# EAGLE design power electronicsV2.1 (EAGLE 9.6.2)

## Sheet 1 of 3
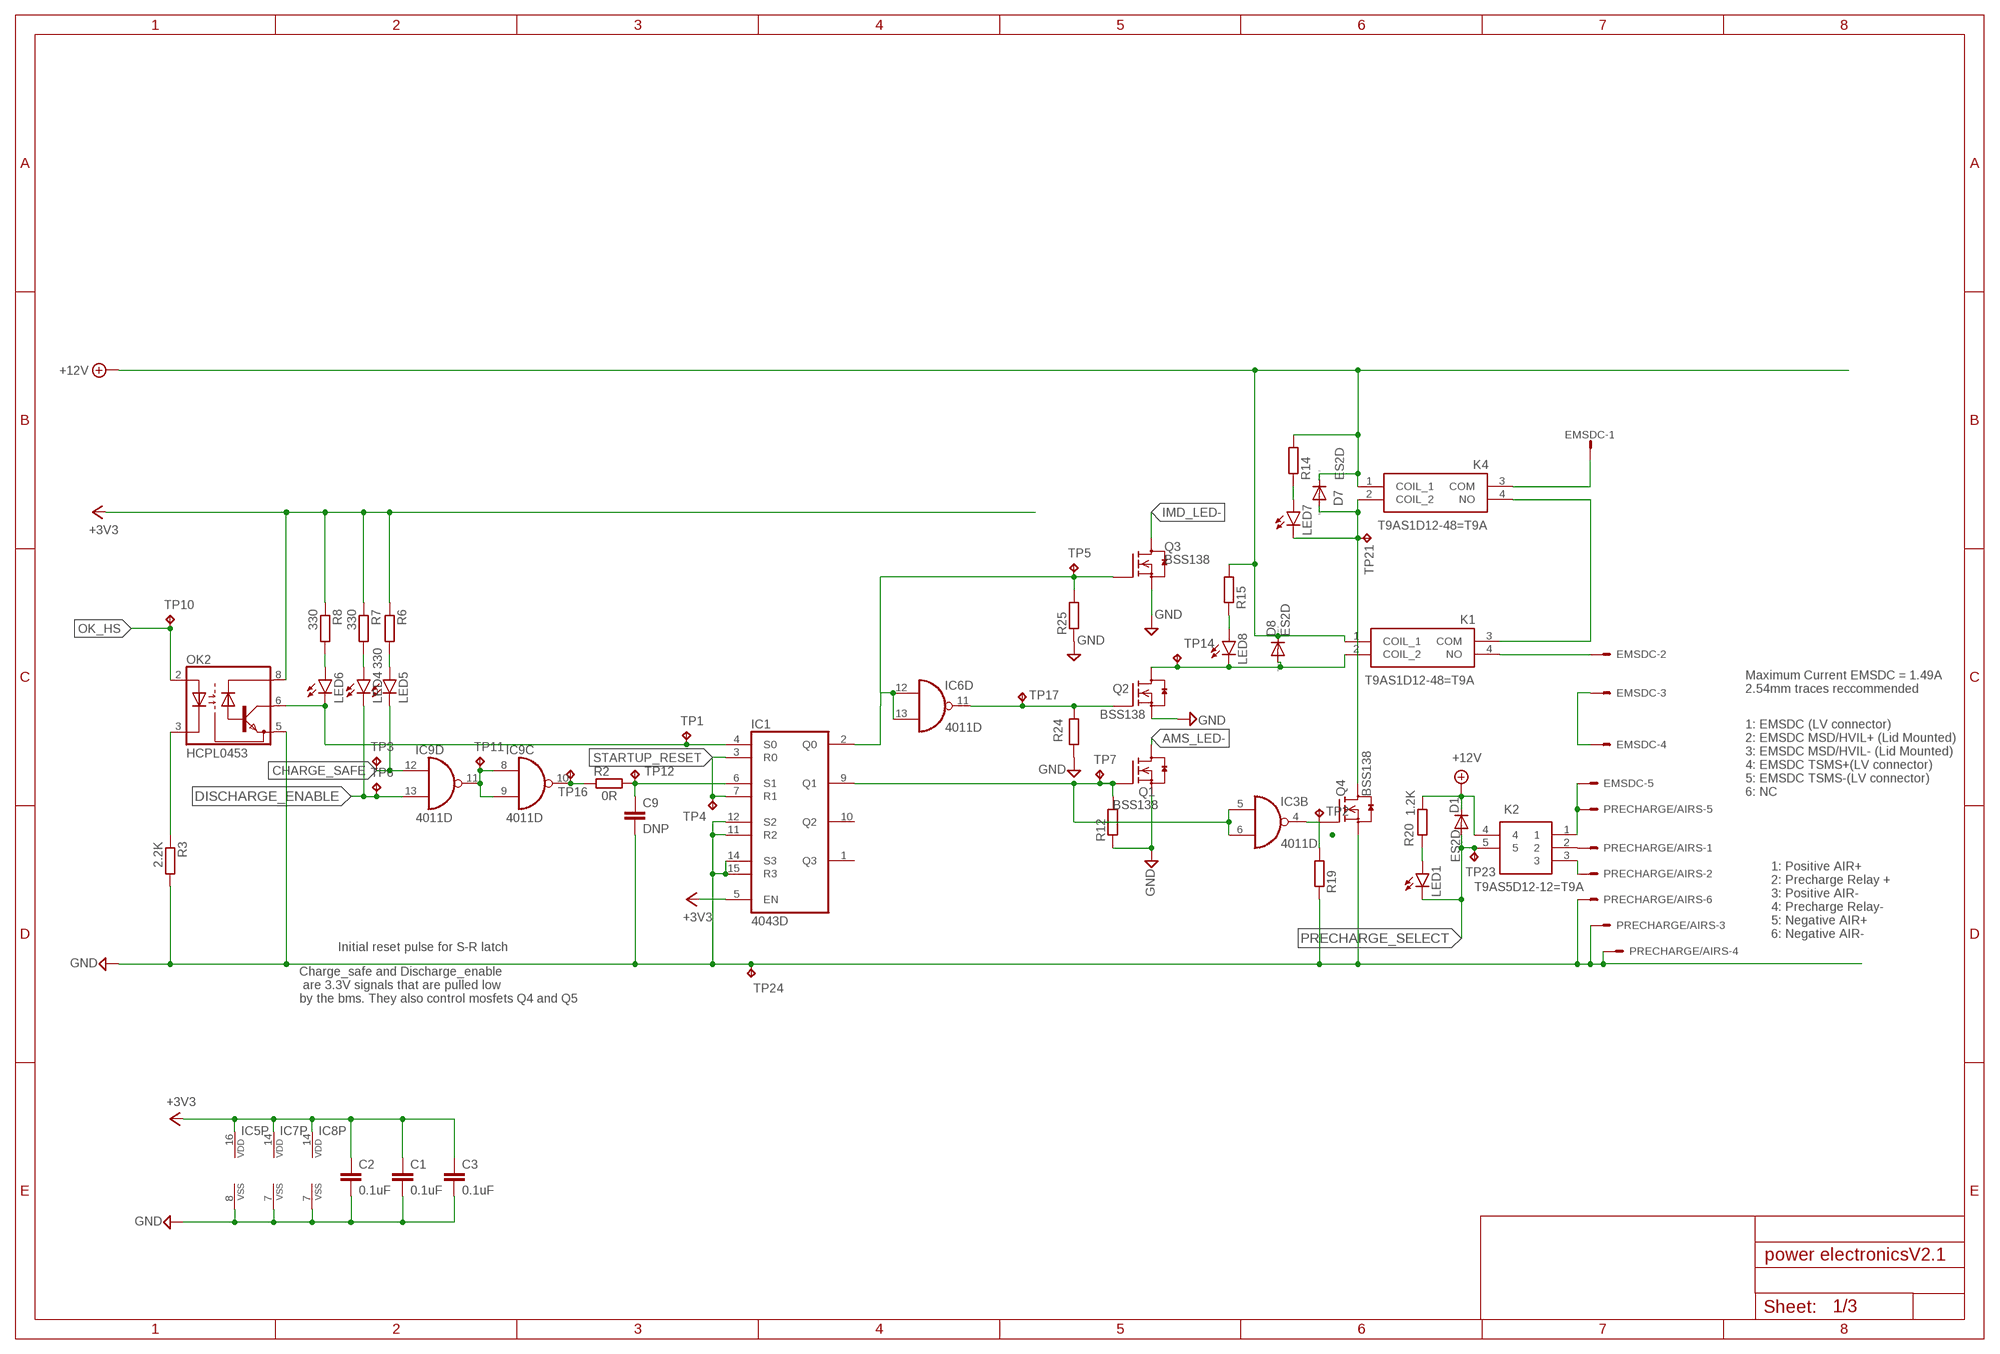
[diagram p0: schematic, sheet 1]

### Parts
C1  0.1uF  C-EUC0805  [C0805]
C2  0.1uF  C-EUC0805  [C0805]
C3  0.1uF  C-EUC0805  [C0805]
C9  DNP  C-EUC0805K  [C0805K]
D1  ES2D  [SMB]
D7  ES2D  [SMB]
D8  ES2D  [SMB]
EMSDC  KK-156-6  [KK-156-6]
IC1  4043D  [SO16]
IC3  4011D  [SO14]
IC5  4043D  [SO16]
IC6  4011D  [SO14]
IC7  4011D  [SO14]
IC8  4011D  [SO14]
IC9  4011D  [SO14]
K1  T9AS1D12-48=T9A  [T9AS1D1248T9A]
K2  T9AS5D12-12=T9A  [T9AS1D12]
K4  T9AS1D12-48=T9A  [T9AS1D1248T9A]
LED1  LEDSML0805  [SML0805]
LED4  LEDSML0805  [SML0805]
LED5  LEDSML0805  [SML0805]
LED6  LEDSML0805  [SML0805]
LED7  LEDSML0805  [SML0805]
LED8  LEDSML0805  [SML0805]
OK2  HCPL0453  [SOIC08]
PRECHARGE/AIRS  KK-156-6  [KK-156-6]
Q1  BSS138  [SOT23]
Q2  BSS138  [SOT23]
Q3  BSS138  [SOT23]
Q4  BSS138  [SOT23]
R2  0R  R-EU_R0805  [R0805]
R3  2.2K  R-EU_R0805  [R0805]
R6  330  R-EU_R0805  [R0805]
R7  330  R-EU_R0805  [R0805]
R8  330  R-EU_R0805  [R0805]
R12  R-EU_R0805  [R0805]
R14  R-EU_R0805  [R0805]
R15  R-EU_R0805  [R0805]
R19  R-EU_R0805  [R0805]
R20  1.2K  R-EU_R0805  [R0805]
R24  R-EU_R0805  [R0805]
R25  R-EU_R0805  [R0805]
TP1  TPPAD1-17  [P1-17]
TP2  TPPAD1-17  [P1-17]
TP3  TPPAD1-17  [P1-17]
TP4  TPPAD1-17  [P1-17]
TP5  TPPAD1-17  [P1-17]
TP6  TPPAD1-17  [P1-17]
TP7  TPPAD1-17  [P1-17]
TP10  TPPAD1-17  [P1-17]
TP11  TPPAD1-17  [P1-17]
TP12  TPPAD1-17  [P1-17]
TP14  TPPAD1-17  [P1-17]
TP16  TPPAD1-17  [P1-17]
TP17  TPPAD1-17  [P1-17]
TP21  TPPAD1-17  [P1-17]
TP23  TPPAD1-17  [P1-17]
TP24  TPPAD1-17  [P1-17]

### Nets
+3V3: C1.1 C2.1 C3.1 IC1.5(EN) IC5.16(VDD) IC7.14(P:VDD) IC8.14(P:VDD) OK2.8(VCC) R6.1 R7.1 R8.1 ; also sheet 2
+12V [power]: D1.C D7.C D8.C K1.1(COIL_1) K2.4 K4.1(COIL_1) R14.2 R15.2 R20.1 ; also sheet 2,3
AMS_LED-: Q1.3(D) ; also sheet 3
CHARGE_SAFE: IC9.12(D:I0) LED5.C TP3.TP ; also sheet 3
DISCHARGE_ENABLE: IC1.9(Q1) IC3.5(B:I0) IC3.6(B:I1) IC9.13(D:I1) LED4.C Q1.1(G) R12.2 TP6.TP TP7.TP ; also sheet 3
GND [GND]: C1.2 C2.2 C3.2 C9.2 IC1.11(R2) IC1.12(S2) IC1.14(S3) IC1.15(R3) IC5.8(VSS) IC7.7(P:VSS) IC8.7(P:VSS) OK2.5(GND) PRECHARGE/AIRS.3 PRECHARGE/AIRS.4 PRECHARGE/AIRS.6 Q1.2(S) Q2.2(S) Q3.2(S) Q4.2(S) R3.2 R12.1 R19.1 R24.1 R25.1 TP24.TP ; also sheet 2,3
IMD_COIL_OUT: D8.A K1.2(COIL_2) LED8.C Q2.3(D) TP14.TP
IMD_LED-: Q3.3(D) ; also sheet 3
N$1: IC9.10(C:O) R2.1 TP16.TP
N$3 [EMSDC]: K2.2 PRECHARGE/AIRS.1
N$5: IC1.4(S0) LED6.C OK2.6(VO) TP1.TP
N$6: IC9.8(C:I0) IC9.9(C:I1) IC9.11(D:O) TP11.TP
N$7: OK2.3(C) R3.1
N$8: IC6.11(D:O) Q2.1(G) R24.2 TP17.TP
N$9: IC1.2(Q0) IC6.12(D:I0) IC6.13(D:I1) Q3.1(G) R25.2 TP5.TP
N$10: C9.1 IC1.6(S1) R2.2 TP12.TP
N$11 [EMSDC]: EMSDC.5 K2.1 PRECHARGE/AIRS.5
N$12 [EMSDC]: K2.3 PRECHARGE/AIRS.2
N$13 [power]: EMSDC.1 K4.3(COM)
N$14: EMSDC.2 K1.4(NO)
N$15 [GND]: D7.A K4.2(COIL_2) LED7.C Q4.3(D) TP21.TP
N$16: IC3.4(B:O) Q4.1(G) R19.2 TP2.TP
N$18: LED7.A R14.1
N$19 [EMSDC]: EMSDC.3 EMSDC.4
N$20: LED8.A R15.1
N$21 [GND]: K1.3(COM) K4.4(NO)
N$22: LED1.A R20.2
N$25: LED4.A R7.2
N$26: LED5.A R6.2
N$27: LED6.A R8.2
OK_HS: OK2.2(A) TP10.TP ; also sheet 3
PRECHARGE_SELECT: D1.A K2.5 LED1.C TP23.TP ; also sheet 3
STARTUP_RESET: IC1.3(R0) IC1.7(R1) TP4.TP ; also sheet 2
Unconnected: EMSDC.6 IC1.1(Q3) IC1.10(Q2) IC3.1(A:I0) IC3.2(A:I1) IC3.3(A:O) IC3.8(C:I0) IC3.9(C:I1) IC3.10(C:O) IC3.11(D:O) IC3.12(D:I0) IC3.13(D:I1) IC5.1(Q3) IC5.2(Q0) IC5.3(R0) IC5.4(S0) IC5.5(EN) IC5.6(S1) IC5.7(R1) IC5.9(Q1) IC5.10(Q2) IC5.11(R2) IC5.12(S2) IC5.14(S3) IC5.15(R3) IC6.1(A:I0) IC6.2(A:I1) IC6.3(A:O) IC6.4(B:O) IC6.5(B:I0) IC6.6(B:I1) IC6.8(C:I0) IC6.9(C:I1) IC6.10(C:O) IC7.1(A:I0) IC7.2(A:I1) IC7.3(A:O) IC7.4(B:O) IC7.5(B:I0) IC7.6(B:I1) IC7.8(C:I0) IC7.9(C:I1) IC7.10(C:O) IC7.11(D:O) IC7.12(D:I0) IC7.13(D:I1) IC8.1(A:I0) IC8.2(A:I1) IC8.3(A:O) IC8.4(B:O) IC8.5(B:I0) IC8.6(B:I1) IC8.8(C:I0) IC8.9(C:I1) IC8.10(C:O) IC8.11(D:O) IC8.12(D:I0) IC8.13(D:I1) IC9.1(A:I0) IC9.2(A:I1) IC9.3(A:O) IC9.4(B:O) IC9.5(B:I0) IC9.6(B:I1)

### Notes on the sheet
- Maximum Current EMSDC = 1.49A
  2.54mm traces reccommended
- 1: EMSDC (LV connector)
  2: EMSDC MSD/HVIL+ (Lid Mounted)
  3: EMSDC MSD/HVIL- (Lid Mounted)
  4: EMSDC TSMS+(LV connector)
  5: EMSDC TSMS-(LV connector)
  6: NC
- 1: Positive AIR+
  2: Precharge Relay +
  3: Positive AIR-
  4: Precharge Relay-
  5: Negative AIR+
  6: Negative AIR-
- Initial reset pulse for S-R latch
- Charge_safe and Discharge_enable
   are 3.3V signals that are pulled low 
  by the bms. They also control mosfets Q4 and Q5

## Sheet 2 of 3
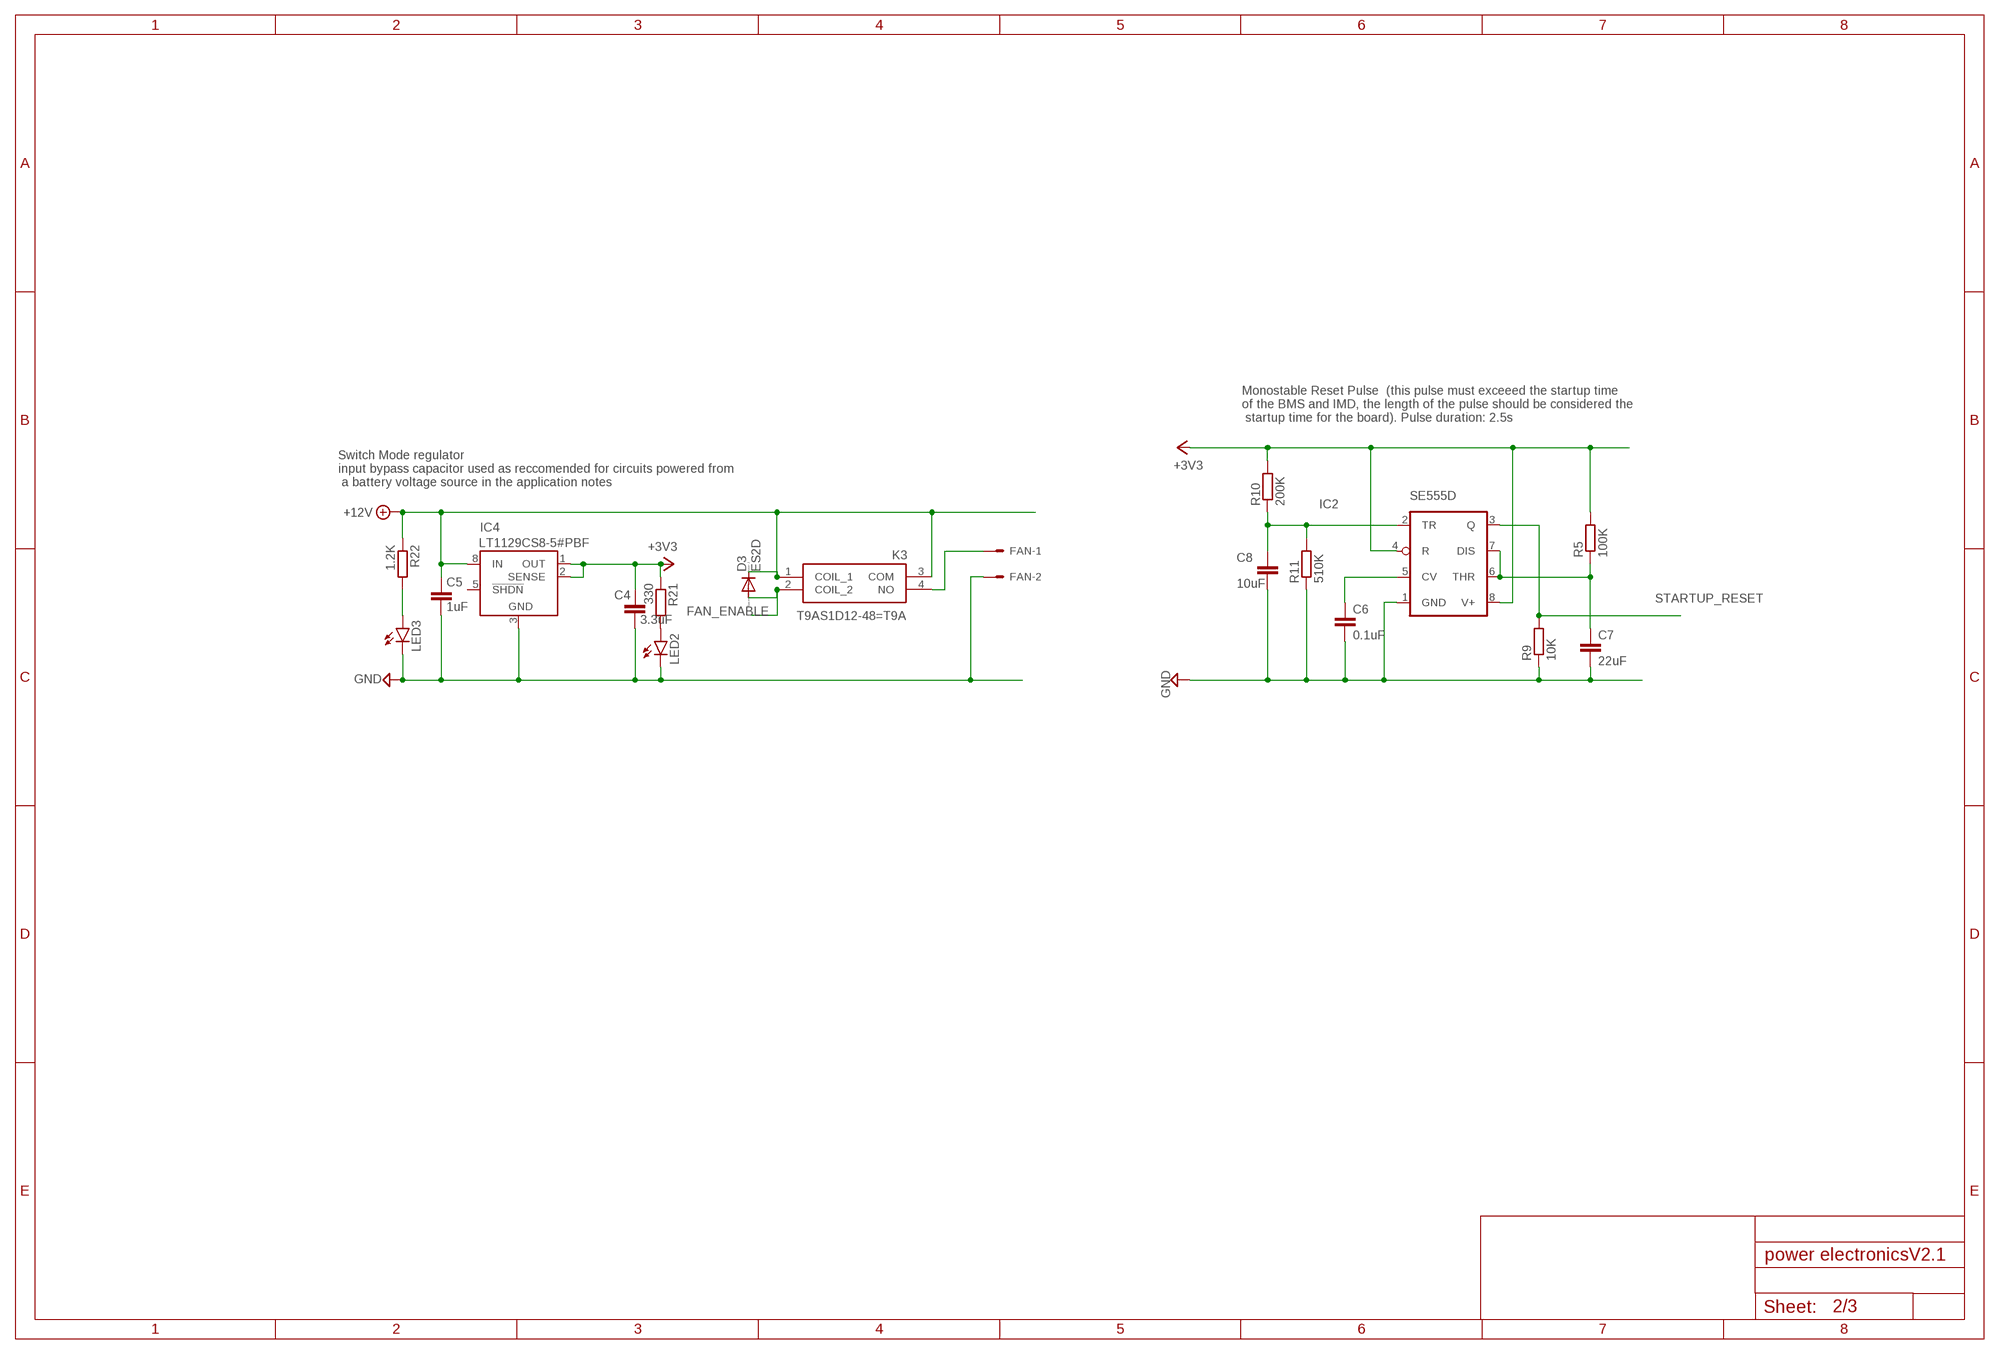
[diagram p1: schematic, sheet 2]

### Parts
C4  3.3uF  C-EUC0805  [C0805]
C5  1uF  C-EUC0805  [C0805]
C6  0.1uF  C-EUC0805  [C0805]
C7  22uF  C-EUC1206  [C1206]
C8  10uF  C-EUC0805  [C0805]
D3  ES2D  [SMB]
FAN  KK-156-2  [KK-156-2]
IC2  SE555D  [SO08]
IC4  LT1129CS8  [SOIC8]
K3  T9AS1D12-48=T9A  [T9AS1D1248T9A]
LED2  LEDSML0805  [SML0805]
LED3  LEDSML0805  [SML0805]
R5  100K  R-EU_R0805  [R0805]
R9  10K  R-EU_R0805  [R0805]
R10  200K  R-EU_R0805  [R0805]
R11  510K  R-EU_R0805  [R0805]
R21  330  R-EU_R0805  [R0805]
R22  1.2K  R-EU_R0805  [R0805]

### Nets
+3V3: C4.1 IC2.4(R) IC2.8(V+) IC4.1(OUT) IC4.2(SENSE) R5.2 R10.2 R21.1 ; also sheet 1
+12V [power]: C5.1 D3.C IC4.8(IN) K3.1(COIL_1) K3.3(COM) R22.1 ; also sheet 1,3
FAN+ [power]: FAN.1 K3.4(NO)
FAN_ENABLE: D3.A K3.2(COIL_2) ; also sheet 3
GND [GND]: C4.2 C5.2 C6.2 C7.2 C8.2 FAN.2 IC2.1(GND) IC4.3(GND) LED2.C LED3.C R9.1 R11.1 ; also sheet 1,3
N$17: C7.1 IC2.6(THR) IC2.7(DIS) R5.1
N$23: LED2.A R21.2
N$24: LED3.A R22.2
N$28: C8.1 IC2.2(TR) R10.1 R11.2
N$32: C6.1 IC2.5(CV)
STARTUP_RESET: IC2.3(Q) R9.2 ; also sheet 1
Unconnected: IC4.4(NC) IC4.5(!SHDN)

### Notes on the sheet
- Monostable Reset Pulse  (this pulse must exceeed the startup time 
  of the BMS and IMD, the length of the pulse should be considered the
   startup time for the board). Pulse duration: 2.5s
- Switch Mode regulator
  input bypass capacitor used as reccomended for circuits powered from
   a battery voltage source in the application notes

## Sheet 3 of 3
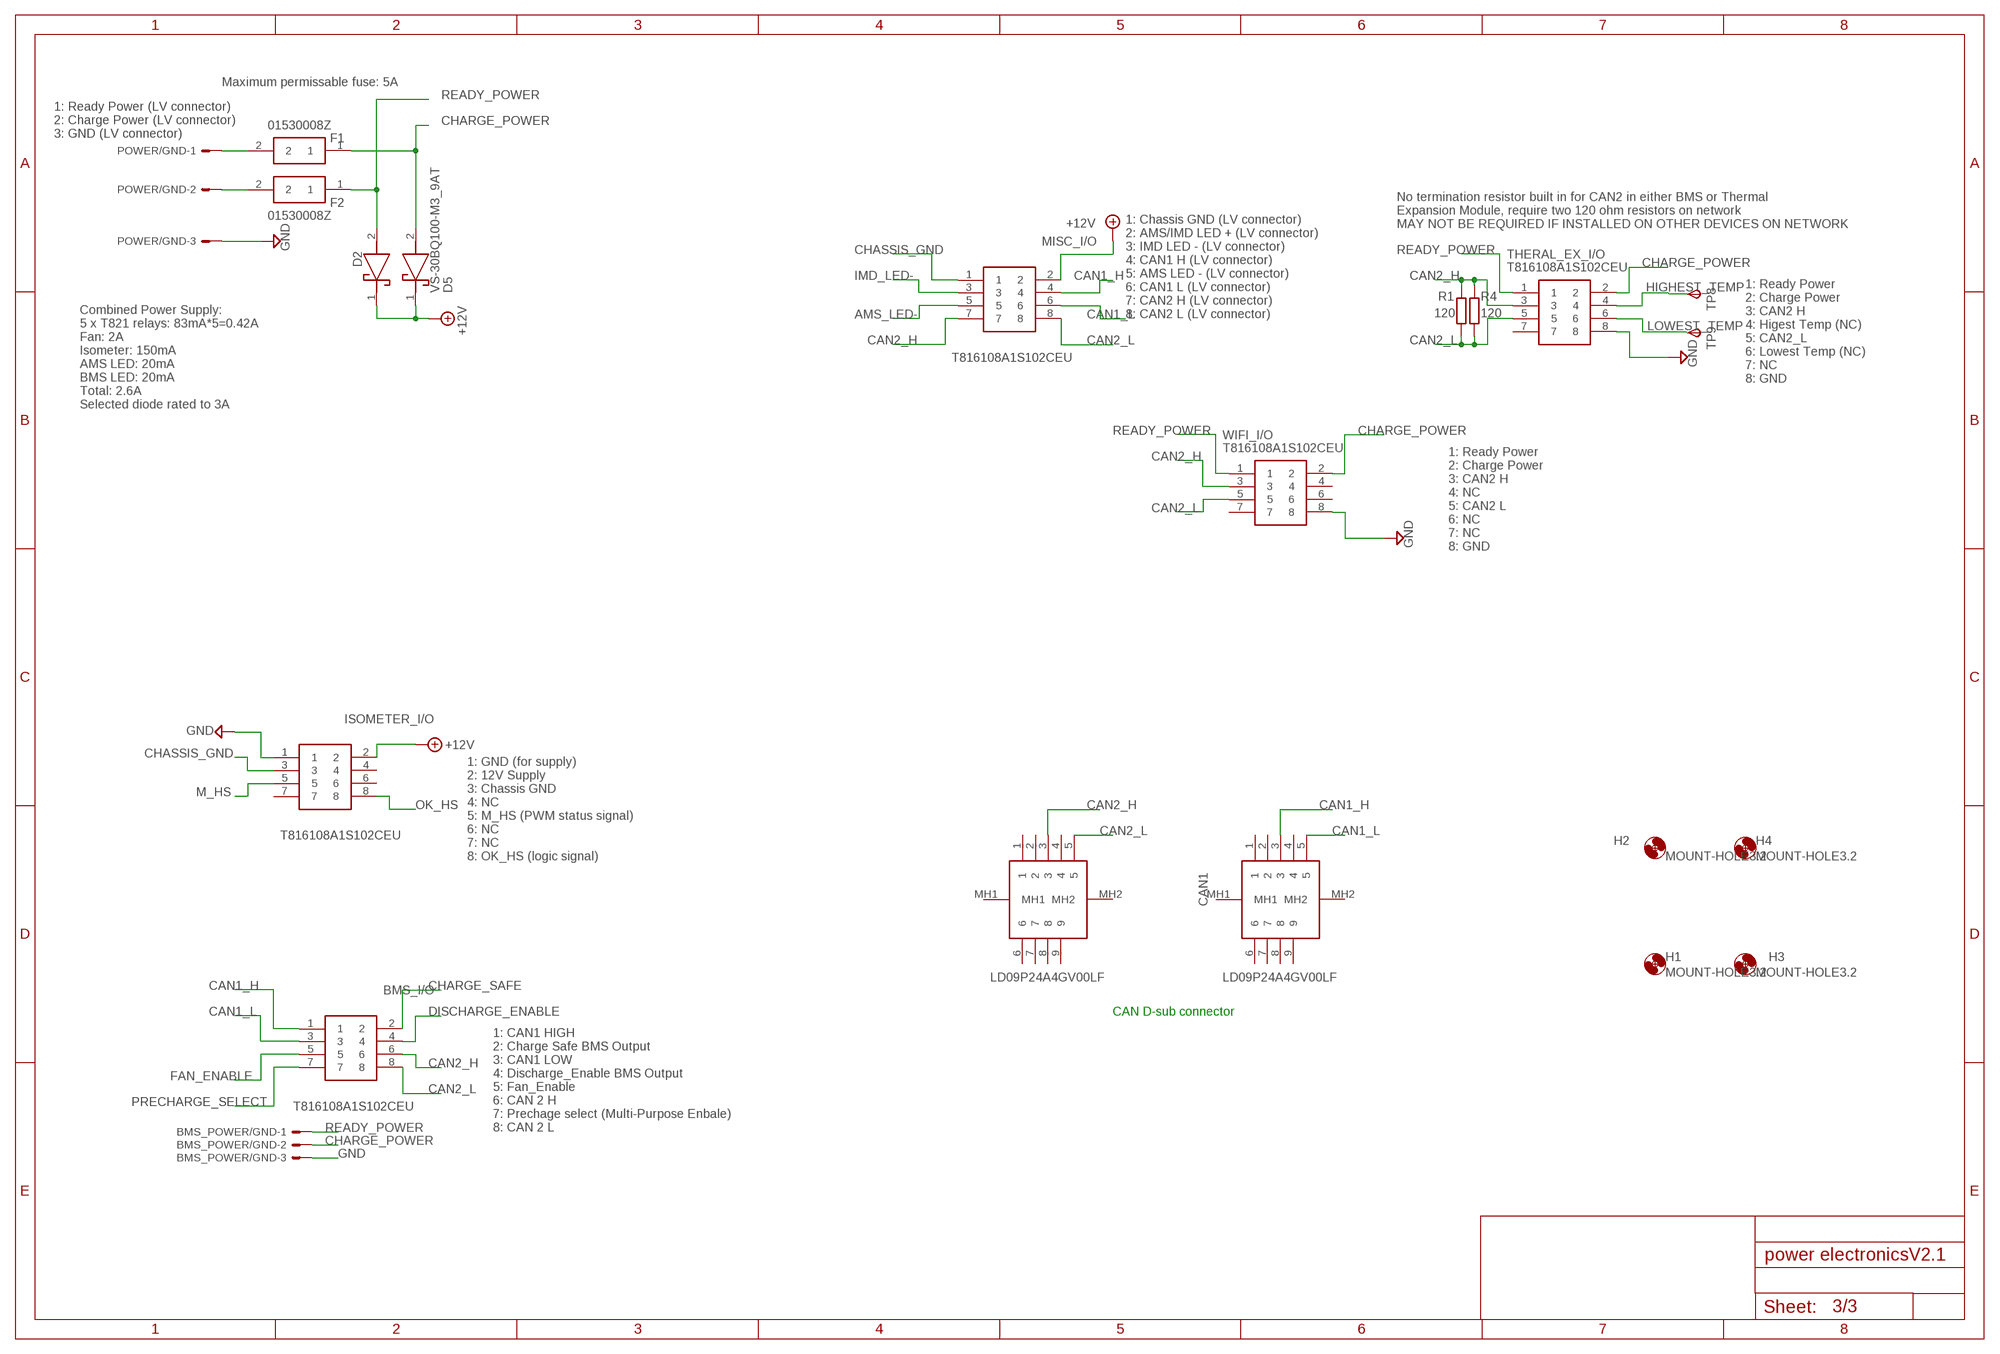
[diagram p2: schematic, sheet 3]

### Parts
BMS_I/O  T816108A1S102CEU  [T816108A1S102CEU]
BMS_POWER/GND  KK-156-3  [KK-156-3]
CAN1  LD09P24A4GV00LF  [LD09P24A4GV00LF]
CAN2  LD09P24A4GV00LF  [LD09P24A4GV00LF]
D2  VS-30BQ100-M3_9AT  [DIOM7959X262N]
D5  VS-30BQ100-M3_9AT  [DIOM7959X262N]
F1  01530008Z  [01530008]
F2  01530008Z  [01530008]
H1  MOUNT-HOLE3.2  [3,2]
H2  MOUNT-HOLE3.2  [3,2]
H3  MOUNT-HOLE3.2  [3,2]
H4  MOUNT-HOLE3.2  [3,2]
ISOMETER_I/O  T816108A1S102CEU  [T816108A1S102CEU]
MISC_I/O  T816108A1S102CEU  [T816108A1S102CEU]
POWER/GND  KK-156-3  [KK-156-3]
R1  120  R-EU_R1206  [R1206]
R4  120  R-EU_R1206  [R1206]
THERAL_EX_I/O  T816108A1S102CEU  [T816108A1S102CEU]
TP8  TPSTP11R  [TP11R]
TP9  TPSTP11R  [TP11R]
WIFI_I/O  T816108A1S102CEU  [T816108A1S102CEU]

### Nets
+12V [power]: D2.1(K) D5.1(K) ISOMETER_I/O.2 MISC_I/O.2 ; also sheet 1,2
AMS_LED-: MISC_I/O.5 ; also sheet 1
CAN1_H: BMS_I/O.1 CAN1.3 MISC_I/O.4
CAN1_L: BMS_I/O.3 CAN1.5 MISC_I/O.6
CAN2_H: BMS_I/O.6 CAN2.3 MISC_I/O.7 R1.1 R4.1 THERAL_EX_I/O.3 WIFI_I/O.3
CAN2_L: BMS_I/O.8 CAN2.5 MISC_I/O.8 R1.2 R4.2 THERAL_EX_I/O.5 WIFI_I/O.5
CHARGE_POWER [power]: BMS_POWER/GND.2 D5.2(A) F1.1 THERAL_EX_I/O.2 WIFI_I/O.2
CHARGE_SAFE: BMS_I/O.2 ; also sheet 1
CHASSIS_GND [GND]: ISOMETER_I/O.3 MISC_I/O.1
DISCHARGE_ENABLE: BMS_I/O.4 ; also sheet 1
FAN_ENABLE: BMS_I/O.5 ; also sheet 2
GND [GND]: BMS_POWER/GND.3 ISOMETER_I/O.1 POWER/GND.3 THERAL_EX_I/O.8 WIFI_I/O.8 ; also sheet 1,2
HIGHEST_TEMP: THERAL_EX_I/O.4 TP8.TP(PP)
IMD_LED-: MISC_I/O.3 ; also sheet 1
LOWEST_TEMP: THERAL_EX_I/O.6 TP9.TP(PP)
M_HS: ISOMETER_I/O.5
N$2 [power]: F2.2 POWER/GND.2
N$4 [power]: F1.2 POWER/GND.1
OK_HS: ISOMETER_I/O.8 ; also sheet 1
PRECHARGE_SELECT: BMS_I/O.7 ; also sheet 1
READY_POWER [power]: BMS_POWER/GND.1 D2.2(A) F2.1 THERAL_EX_I/O.1 WIFI_I/O.1
Unconnected: CAN1.1 CAN1.2 CAN1.4 CAN1.6 CAN1.7 CAN1.8 CAN1.9 CAN1.MH1 CAN1.MH2 CAN2.1 CAN2.2 CAN2.4 CAN2.6 CAN2.7 CAN2.8 CAN2.9 CAN2.MH1 CAN2.MH2 ISOMETER_I/O.4 ISOMETER_I/O.6 ISOMETER_I/O.7 THERAL_EX_I/O.7 WIFI_I/O.4 WIFI_I/O.6 WIFI_I/O.7

### Notes on the sheet
- Maximum permissable fuse: 5A
- 1: Ready Power (LV connector)
  2: Charge Power (LV connector)
  3: GND (LV connector)
- No termination resistor built in for CAN2 in either BMS or Thermal
  Expansion Module, require two 120 ohm resistors on network
  MAY NOT BE REQUIRED IF INSTALLED ON OTHER DEVICES ON NETWORK
- 1: Chassis GND (LV connector)
  2: AMS/IMD LED + (LV connector)
  3: IMD LED - (LV connector)
  4: CAN1 H (LV connector)
  5: AMS LED - (LV connector)
  6: CAN1 L (LV connector)
  7: CAN2 H (LV connector)
  8: CAN2 L (LV connector)
- 1: Ready Power
  2: Charge Power
  3: CAN2 H
  4: Higest Temp (NC)
  5: CAN2_L
  6: Lowest Temp (NC)
  7: NC
  8: GND
- Combined Power Supply:
  5 x T821 relays: 83mA*5=0.42A
  Fan: 2A
  Isometer: 150mA
  AMS LED: 20mA
  BMS LED: 20mA
  Total: 2.6A
  Selected diode rated to 3A
- 1: Ready Power
  2: Charge Power
  3: CAN2 H
  4: NC
  5: CAN2 L
  6: NC
  7: NC
  8: GND
- 1: GND (for supply) 
  2: 12V Supply
  3: Chassis GND 
  4: NC 
  5: M_HS (PWM status signal)
  6: NC
  7: NC
  8: OK_HS (logic signal)
- CAN D-sub connector
- 1: CAN1 HIGH
  2: Charge Safe BMS Output 
  3: CAN1 LOW
  4: Discharge_Enable BMS Output
  5: Fan_Enable
  6: CAN 2 H
  7: Prechage select (Multi-Purpose Enbale)
  8: CAN 2 L

## Power pins joined to a net without a drawn wire
GND: IC4.6(GND) IC4.7(GND)
VDD: IC1.16(VDD) IC3.14(P:VDD) IC6.14(P:VDD) IC9.14(P:VDD)
VSS: IC1.8(VSS) IC3.7(P:VSS) IC6.7(P:VSS) IC9.7(P:VSS)

## Library data of the parts
BMS_I/O ISOMETER_I/O MISC_I/O THERAL_EX_I/O WIFI_I/O = T816108A1S102CEU:T816108A1S102CEU: Amphenol T816 Series, 2.54mm Pitch 8 Way 2 Row Straight PCB Header, Solder Termination, 3A Source: Datasheet <https://docs.rs-online.com/fce6/0900766b81359cbb.pdf>; DESCRIPTION: Amphenol T816 Series, 2.54mm Pitch 8 Way 2 Row Straight PCB Header, Solder Termination, 3A; HEIGHT: 27.2mm; MANUFACTURER_NAME: Amphenol; MANUFACTURER_PART_NUMBER: T816108A1S102CEU
BMS_POWER/GND POWER/GND = con-molex:KK-156-3: KK 156 HEADER Source: http://www.molex.com/pdm_docs/sd/026604100_sd.pdf; MF: MOLEX; OC_FARNELL: unknown; OC_NEWARK: unknown
C1-C9 = rcl:C-EU: CAPACITOR, European symbol; SPICEPREFIX: C
CAN1 CAN2 = LD09P24A4GV00LF:LD09P24A4GV00LF: Amphenol FCI LD Series, 9 Way Plug-In Mount D-sub Connector Plug, 2.74mm Pitch, with Screw Source: Datasheet <https://www.mouser.com/datasheet/2/18/10130912-1362365.pdf>; ARROW_PART_NUMBER: LD09P24A4GV00LF; ARROW_PRICE-STOCK: https://www.arrow.com/en/products/ld09p24a4gv00lf/amphenol-fci?region=nac; DESCRIPTION: Amphenol FCI LD Series, 9 Way Plug-In Mount D-sub Connector Plug, 2.74mm Pitch, with Screw; HEIGHT: 12.15mm; MANUFACTURER_NAME: Amphenol Communication Solutions; MANUFACTURER_PART_NUMBER: LD09P24A4GV00LF; MOUSER_PART_NUMBER: 649-LD09P24A4GV00LF; MOUSER_PRICE-STOCK: https://www.mouser.co.uk/ProductDetail/Amphenol-FCI/LD09P24A4GV00LF?qs=tZOhSuJQg1nfkziarphghA%3D%3D
D1 D3 D7 D8 = diode:ES2D: DIODE super fast rectifier, 2 A
D2 D5 = SamacSys_Parts:VS-30BQ100-M3_9AT: Vishay VS-30BQ100-M3/9AT SMT Schottky Diode, 100V 3A, 2-Pin DO-214AB Source: Datasheet <https://componentsearchengine.com/Datasheets/1/VS-30BQ100-M3_9AT.pdf>; DESCRIPTION: Vishay VS-30BQ100-M3/9AT SMT Schottky Diode, 100V 3A, 2-Pin DO-214AB; HEIGHT: 2.62mm; MANUFACTURER_NAME: Vishay; MANUFACTURER_PART_NUMBER: VS-30BQ100-M3/9AT; MOUSER_PART_NUMBER: 78-VS-30BQ100-M39AT; MOUSER_PRICE-STOCK: https://www.mouser.com/Search/Refine.aspx?Keyword=78-VS-30BQ100-M39AT
EMSDC PRECHARGE/AIRS = con-molex:KK-156-6: KK 156 HEADER Source: http://www.molex.com/pdm_docs/sd/026604100_sd.pdf; MF: MOLEX; OC_FARNELL: unknown; OC_NEWARK: unknown
F1 F2 = SamacSys_Parts:01530008Z: Mini fuseholder,15A 32V Littelfuse 15A PCB Mount Fuse Holder Automotive Fuse, 32 V Source: Datasheet <http://www.littelfuse.com/data/en/data_sheets/153_pcmount.pdf>; ALLIED_NUMBER: 70184304; DESCRIPTION: Mini fuseholder,15A 32V Littelfuse 15A PCB Mount Fuse Holder Automotive Fuse, 32 V; HEIGHT: mm; MANUFACTURER_NAME: LITTELFUSE; MANUFACTURER_PART_NUMBER: 01530008Z; RS_PART_NUMBER: 3607317; RS_PRICE-STOCK: https://uk.rs-online.com/web/p/products/3607317
FAN = con-molex:KK-156-2: KK 156 HEADER Source: http://www.molex.com/pdm_docs/sd/026604100_sd.pdf; MF: MOLEX; OC_FARNELL: unknown; OC_NEWARK: unknown
H1-H4 = holes:MOUNT-HOLE: MOUNTING HOLE with drill center marker
IC1 IC5 = 40xx:4043: Quad 3-state NOR R/S LATCH
IC2 = linear:*555: TIMER
IC3 IC6-IC9 = 40xx:4011: Quad 2-input NAND
IC4 = linear-technology:LT1129CS8: VOLTAGE REGULATOR with shutdown; MPN: LT1129CS8-5#PBF; OC_FARNELL: 1273576; OC_NEWARK: 57M2078
K1 K3 K4 = SamacSys_Parts:T9AS1D12-48=T9A: SPST-NO PCB Mount Non-Latching Relay Through Hole, 48V dc Source: Datasheet <http://uk.rs-online.com/web/p/products/6802534P>; DESCRIPTION: SPST-NO PCB Mount Non-Latching Relay Through Hole, 48V dc; HEIGHT: 20.4mm; MANUFACTURER_NAME: TE Connectivity; MANUFACTURER_PART_NUMBER: T9AS1D12-48=T9A; RS_PART_NUMBER: 6802534P; RS_PRICE-STOCK: http://uk.rs-online.com/web/p/products/6802534P
K2 = SamacSys_Parts:T9AS5D12-12=T9A: PCB Relay SPDT 30A 12Vdc,thru hole SPDT PCB Mount Non-Latching Relay Through Hole, 12V dc Source: Datasheet; ALLIED_NUMBER: R1111589; DESCRIPTION: PCB Relay SPDT 30A 12Vdc,thru hole SPDT PCB Mount Non-Latching Relay Through Hole, 12V dc; HEIGHT: mm; MANUFACTURER_NAME: TE Connectivity; MANUFACTURER_PART_NUMBER: T9AS5D12-12=T9A; RS_PART_NUMBER: 6802528; RS_PRICE-STOCK: https://uk.rs-online.com/web/p/products/6802528
LED1-LED8 = led:LED: LED OSRAM: - CHIPLED LG R971, LG N971, LY N971, LG Q971, LY Q971, LO R971, LY R971 LH N974, LH R974 LS Q976, LO Q976, LY Q976 LO Q996 - Hyper CHIPLED LW Q18S LB Q993, LB Q99A, LB R99A - SideLED LS A670, LO A670, LY A670, LG A670, LP A670 LB A673, LV A673, LT A673, LW A673 LH A674 LY A675 LS A676, LA A676, LO A676, LY A676, LW A676 LS A679, LY A679, LG A679 - Hyper Micro SIDELED® LS Y876, LA Y876, LO Y876, LY Y876 LT Y87S - SmartLED LW L88C, LW L88S LB L89C, LB L89S, LG L890 LS L89K, LO L89K, LY L89K LS L896, LA L896, LO L896, LY L896 - TOPLED LS T670, LO T670, LY T670, LG T670, LP T670 LSG T670, LSP T670, LSY T670, LOP T670, LYG T670 LG T671, LOG T671, LSG T671 LB T673, LV T673, LT T673, LW T673 LH T674 LS T676, LA T676, LO T676, LY T676, LB T676, LH T676, LSB T676, LW T676 LB T67C, LV T67C, LT T67C, LS T67K, LO T67K, LY T67K, LW E67C LS E67B, LA E67B, LO E67B, LY E67B, LB E67C, LV E67C, LT E67C LW T67C LS T679, LY T679, LG T679 LS T770, LO T770, LY T770, LG T770, LP T770 LB T773, LV T773, LT T773, LW T773 LH T774 LS E675, LA E675, LY E675, LS T675 LS T776, LA T776, LO T776, LY T776, LB T776 LHGB T686 LT T68C, LB T68C - Hyper Mini TOPLED® LB M676 - Mini TOPLED Santana® LG M470 LS M47K, LO M47K, LY M47K Source: http://www.osram.convergy.de LUXEON: - LUMILED® LXK2-PW12-R00, LXK2-PW12-S00, LXK2-PW14-U00, LXK2-PW14-V00 LXK2-PM12-R00, LXK2-PM12-S00, LXK2-PM14-U00 LXK2-PE12-Q00, LXK2-PE12-R00, LXK2-PE12-S00, LXK2-PE14-T00, LXK2-PE14-U00 LXK2-PB12-K00, LXK2-PB12-L00, LXK2-PB12-M00, LXK2-PB14-N00, LXK2-PB14-P00, LXK2-PB14-Q00 LXK2-PR12-L00, LXK2-PR12-M00, LXK2-PR14-Q00, LXK2-PR14-R00 LXK2-PD12-Q00, LXK2-PD12-R00, LXK2-PD12-S00 LXK2-PH12-R00, LXK2-PH12-S00 LXK2-PL12-P00, LXK2-PL12-Q00, LXK2-PL12-R00 Source: www.luxeon.com KINGBRIGHT: KA-3528ASYC Source: www.kingbright.com
OK2 = optocoupler:HCPL0453: HEWLETT PACKARD OPTO COUPLER; MF: AGILENT TECHNOLOGIES; MPN: HCPL-0453-000E; OC_FARNELL: 1505123; OC_NEWARK: 88H7766
Q1-Q4 = m-pad-2.1:BSS138: Fairchild Semiconductors BSS138 N-Channel Logic Level Enhancement Mode Field Effect Transistor General Description: These N-Channel enhancement mode field effect transistors are produced using Fairchild's proprietary, high cell density, DMOS technology. These products have been designed to minimize on-state resistance while provide rugged, reliable, and fast switching performance.These products are particularly suited for low voltage, low current applications such as small servo motor control, power MOSFET gate drivers, and other switching applications. Features: 0.22 A, 50 V. RDS(ON) = 3.5Ohm @ VGS = 10 V RDS(ON) = 6.0Ohm @ VGS = 4.5 V High density cell design for extremely low RDS(ON) Rugged and Reliable Compact industry standard SOT-23 surface mount package Please send any comments to: messi@users.sourceforge.net
R1-R12 R14 R15 R19-R22 R24 R25 = rcl:R-EU_: RESISTOR, European symbol; SPICEPREFIX: R
TP1-TP7 TP10-TP12 TP14 TP16 TP17 TP21 TP23 TP24 = testpad:TP: Test pad
TP8 TP9 = testpad:TPS: TEST PIN

## Net classes
0 default: width 0.508 mm
1 GND: width 0.889 mm
2 EMSDC: width 2.54 mm
3 power: width 0.889 mm

## Board
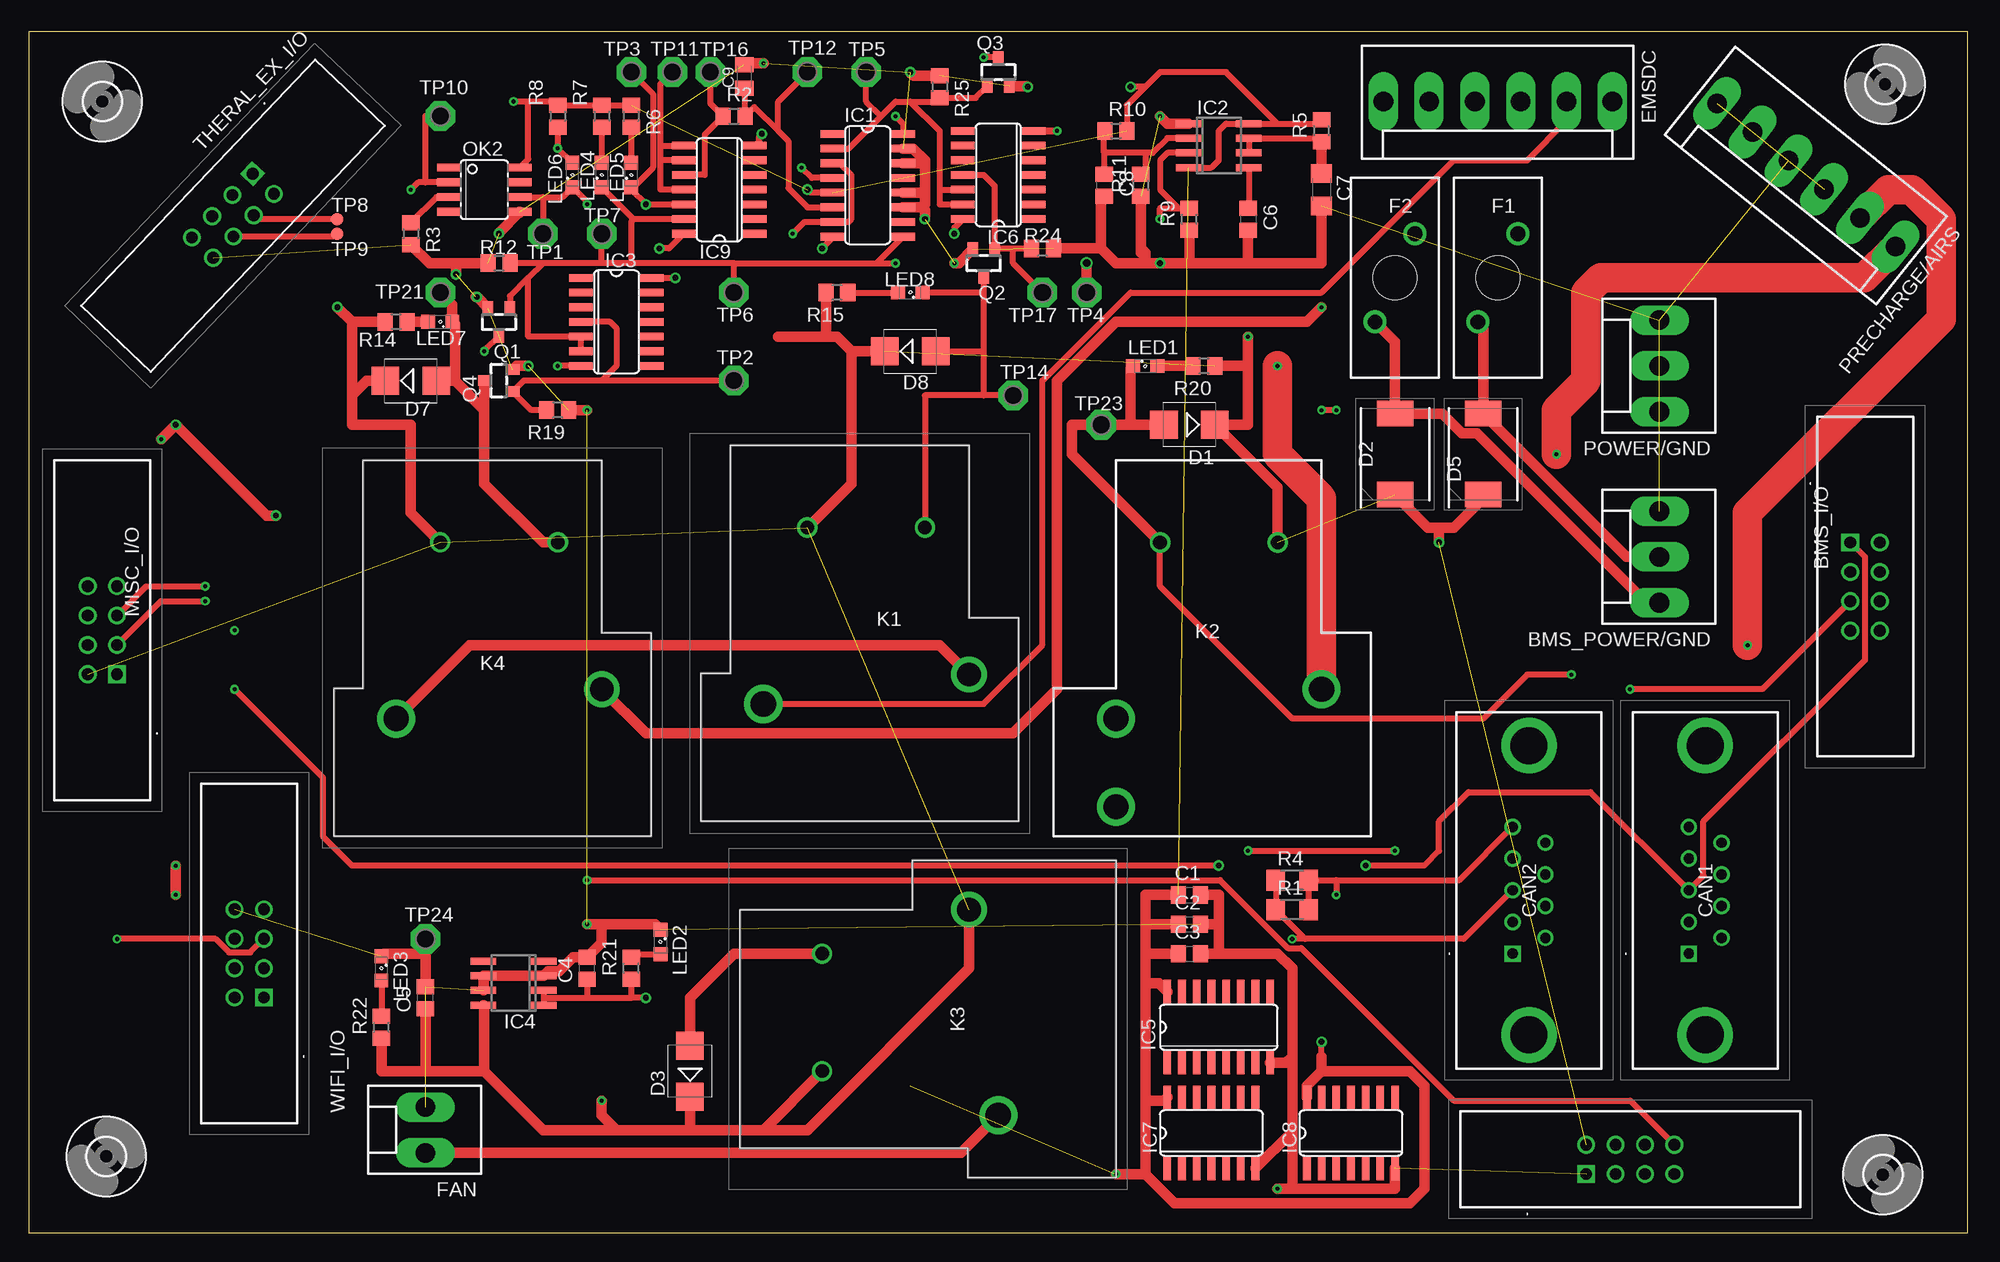
[diagram p3: board, top side]
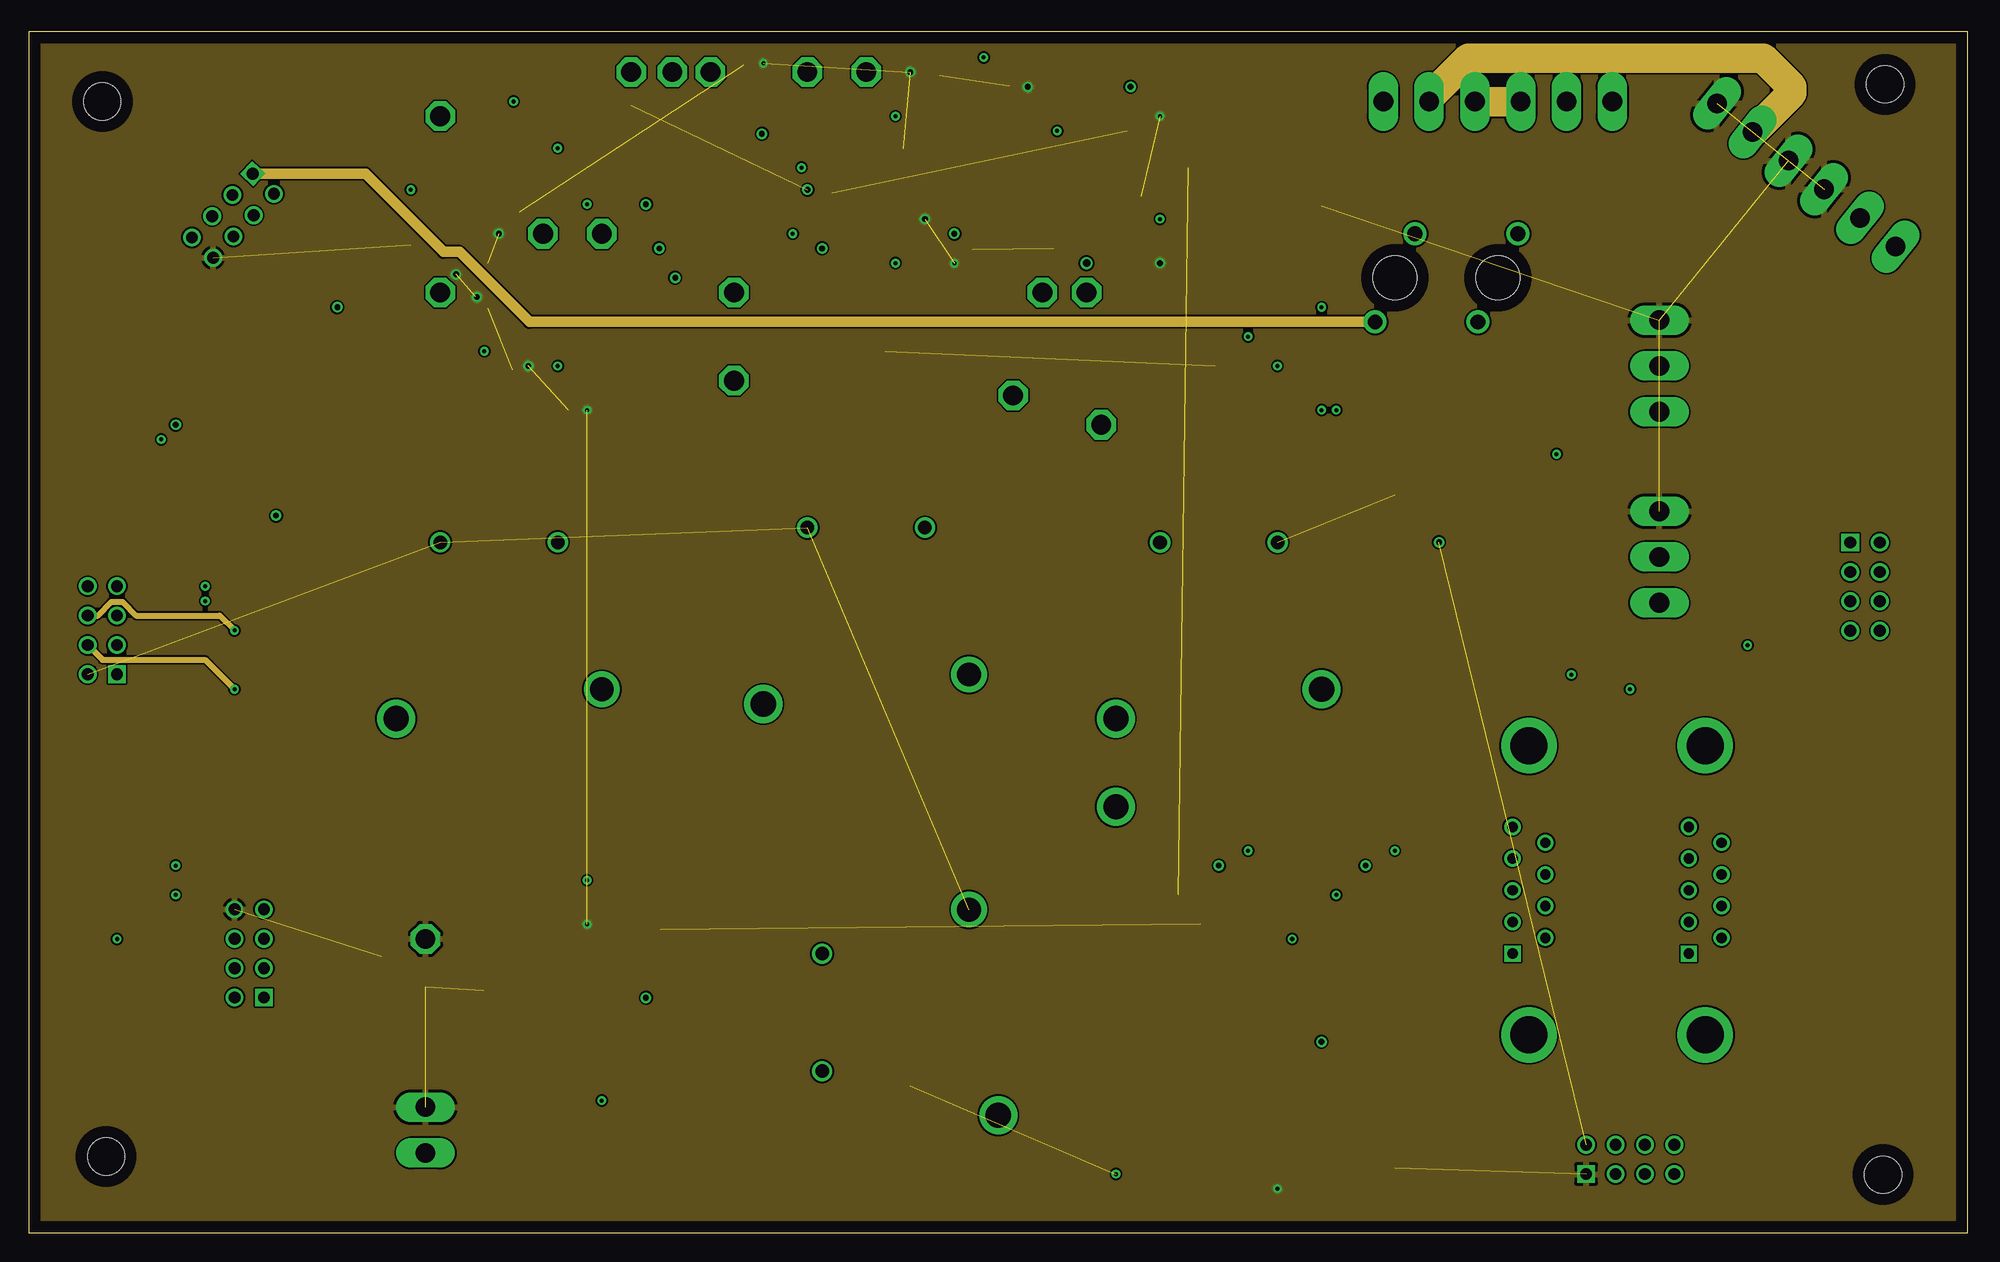
[diagram p4: board, inner layer Route2]
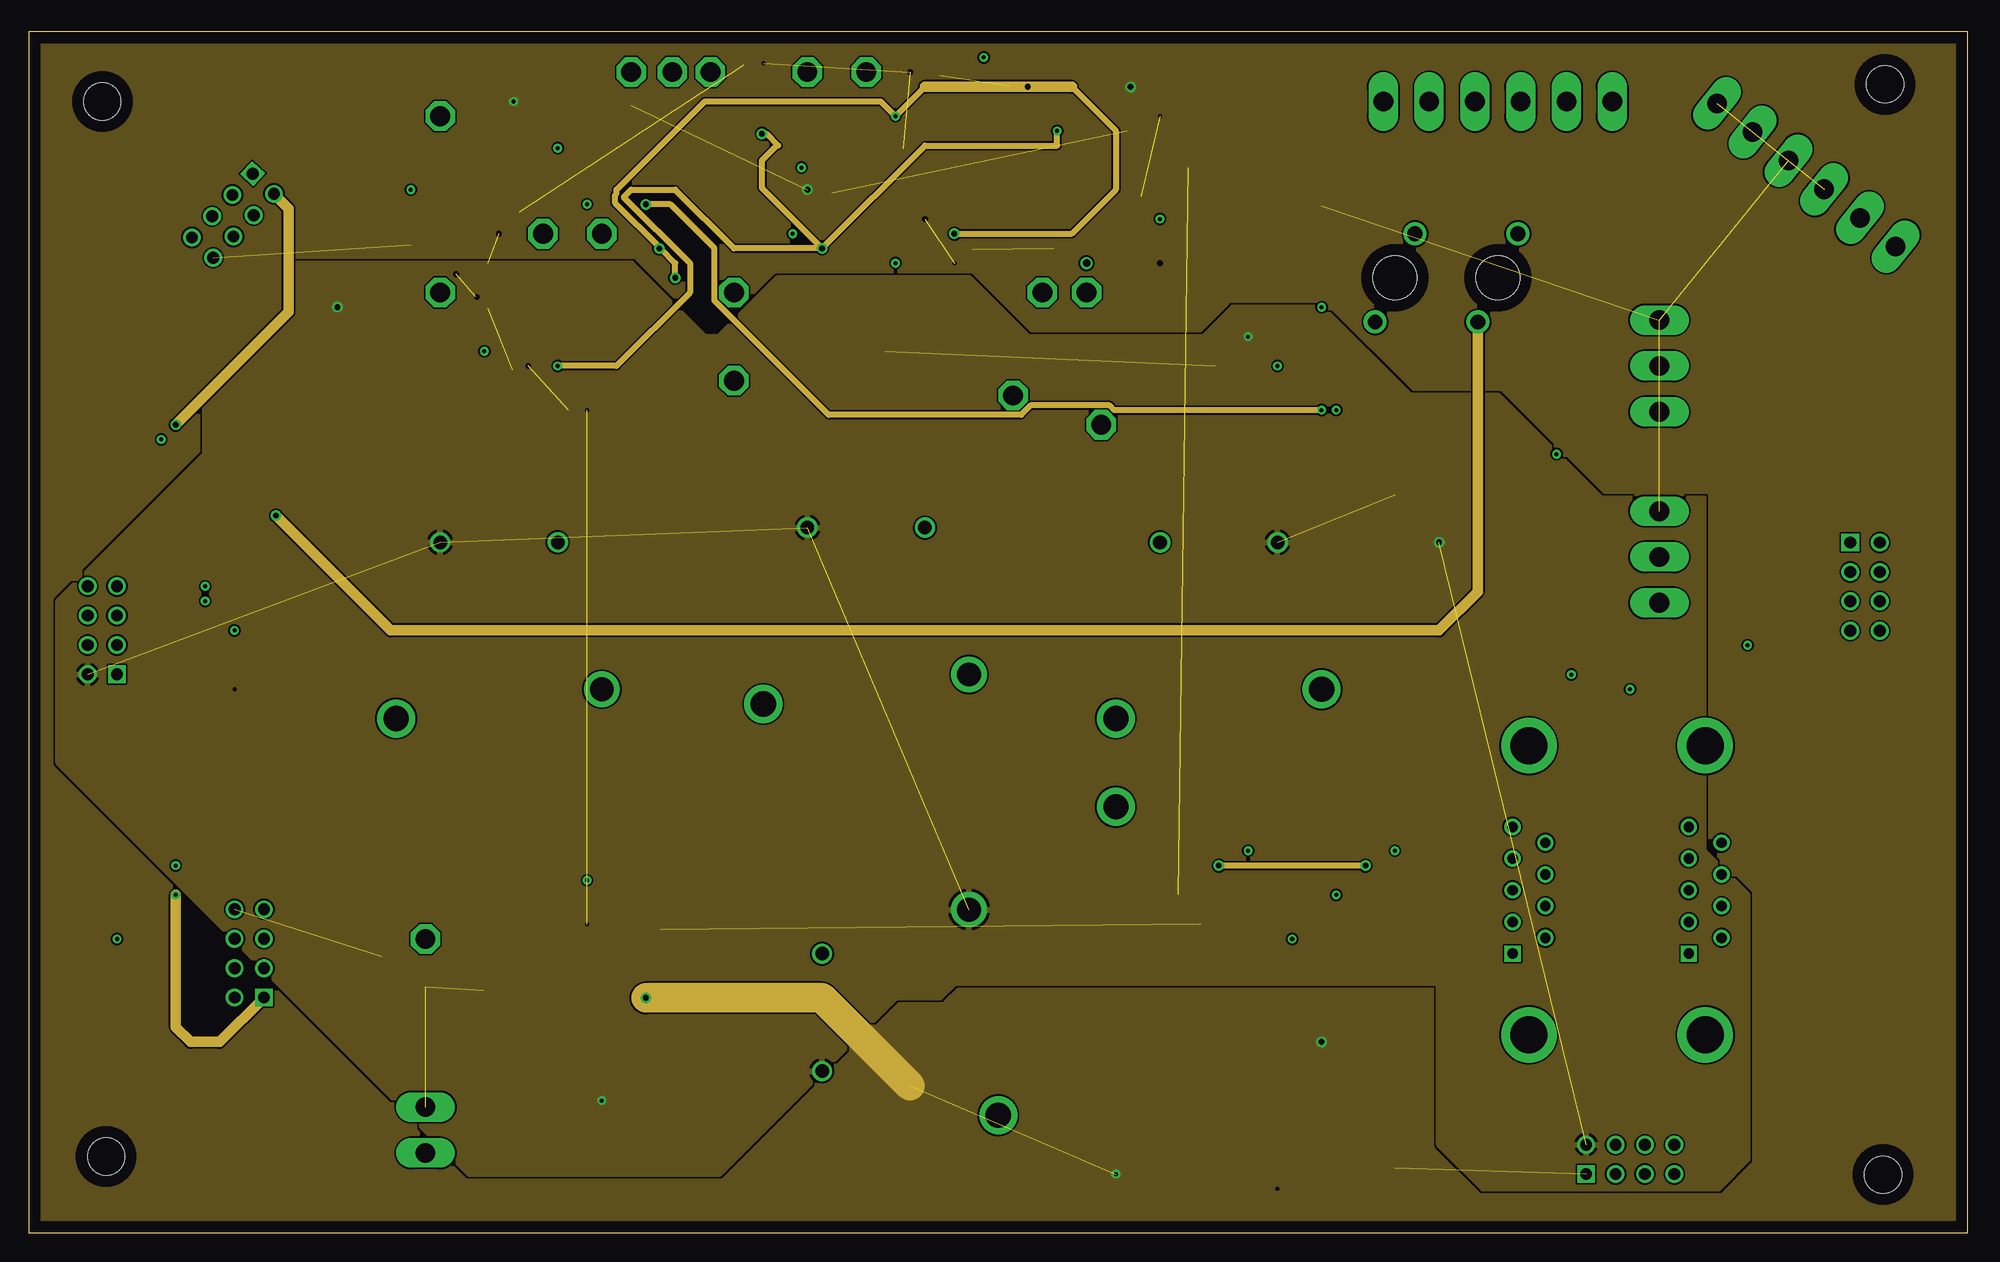
[diagram p5: board, inner layer Route15]
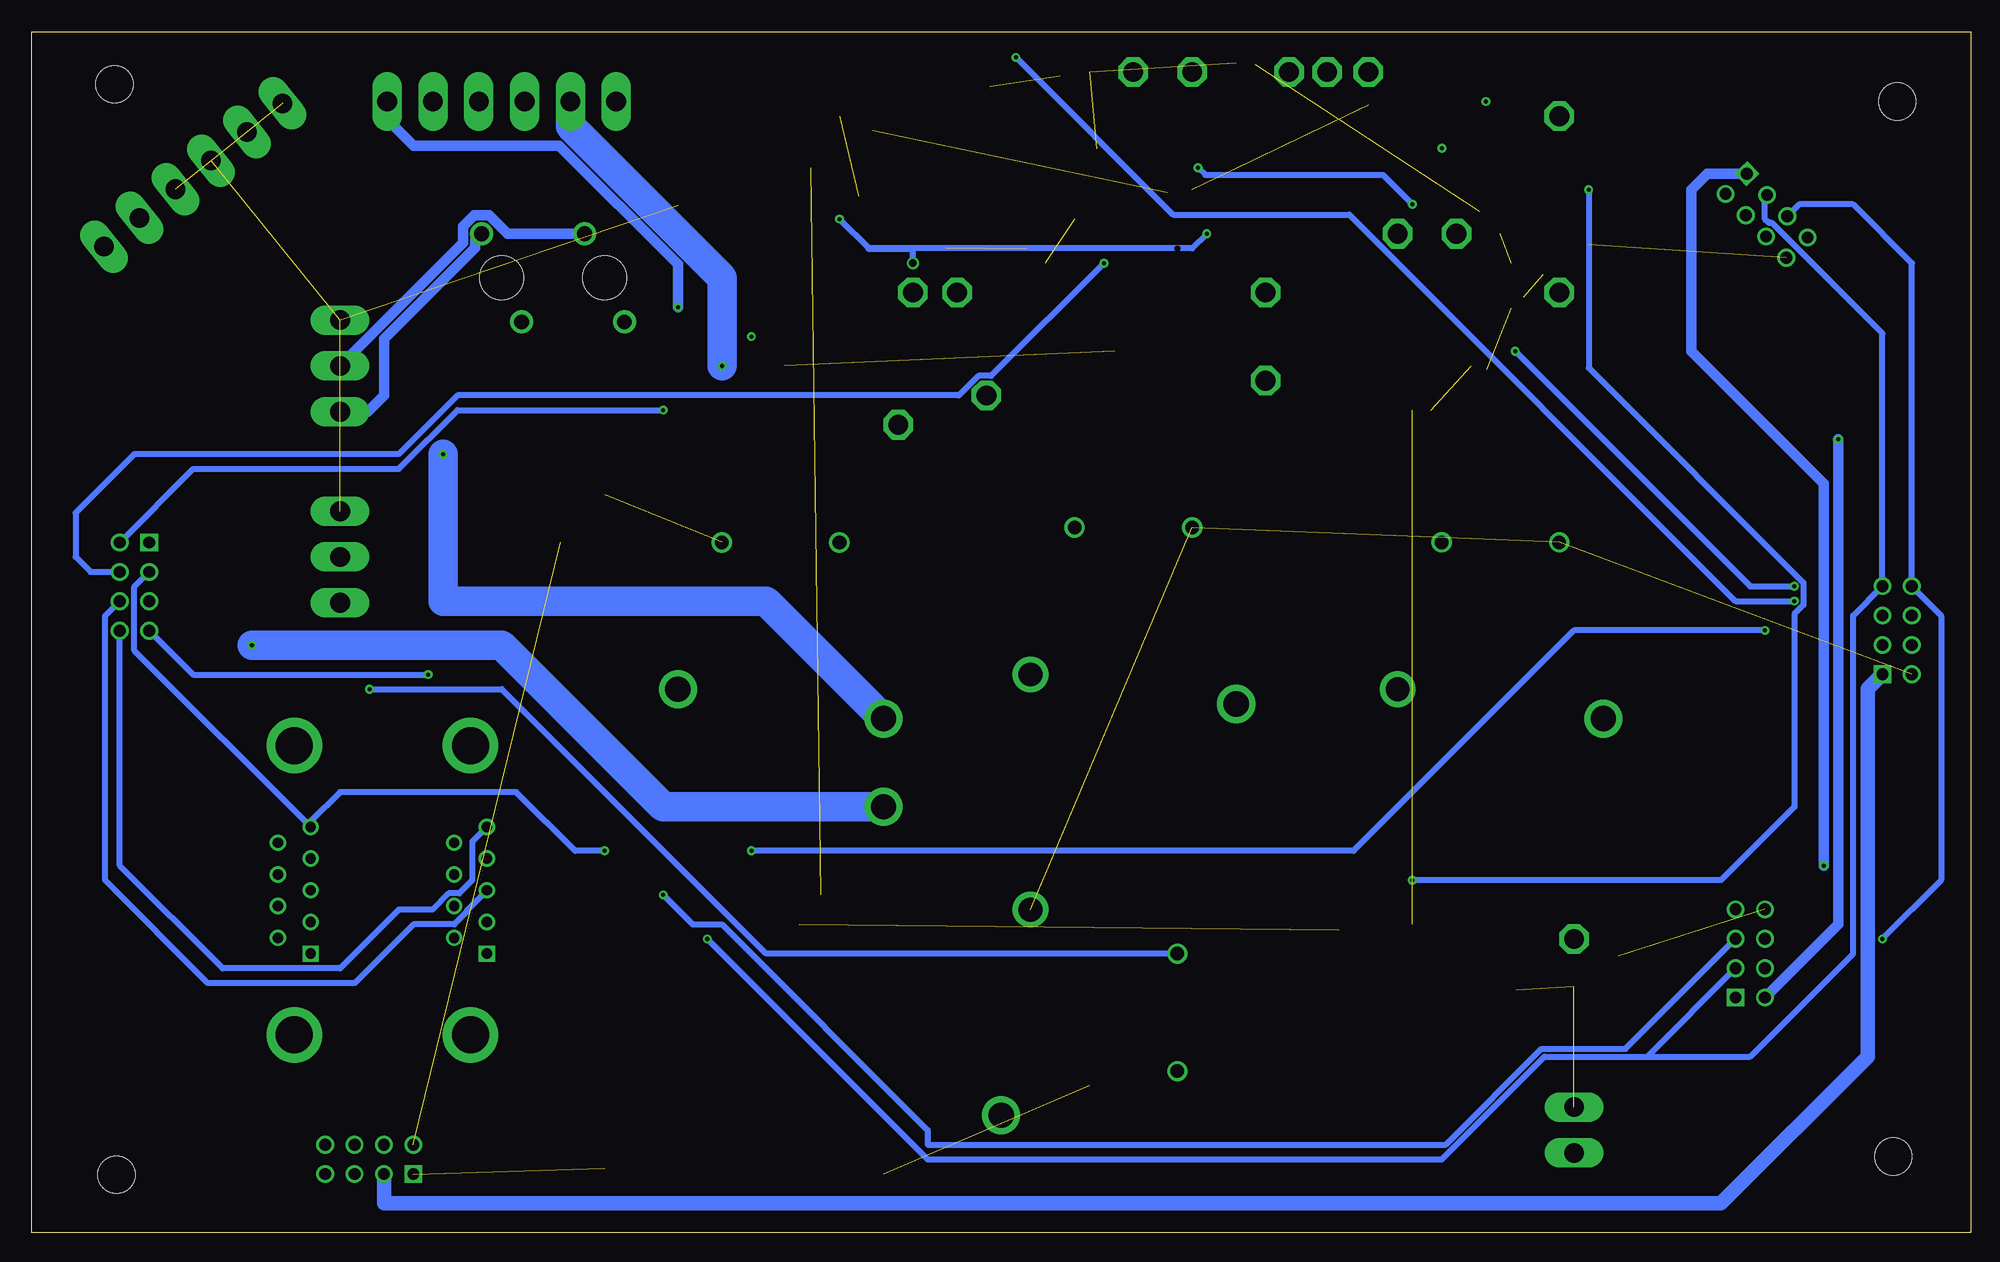
[diagram p6: board, bottom side, seen from below]

Size 167.62 x 103.81 mm. Coordinates in mm from the lower left corner, seen from the top.
Outline: 0,0 167.62,0 167.62,103.81 0,103.81 0,0
Copper layers ([2:[15:1+2*15+16]]): Top 0.035mm / dielectric 1.5mm / Route2 0.035mm / dielectric 0.15mm / Route15 0.035mm / dielectric 0.2mm / Bottom 0.035mm
Design rules "default *": minimum track width 6mil, minimum drill 0.35mm, track to track 6mil, track to pad 6mil, pad to pad 6mil, via to via 6mil, smd to smd 6mil, copper to edge 40mil, drill to drill 6mil, minimum pad ring 10mil, minimum via ring 8mil, stop-mask expansion 4mil, vias tented up to drill 0mil, thermal gap 10mil

### Footprints (pad centres in the part's own frame; a part is rotated, then mirrored left to right if it is on the bottom)
T816108A1S102CEU = drill 1.02 pad 1.53 square: 1 5.1,0 | drill 1.02 pad 1.53: 2 5.1,2.54; 3 7.64,0; 4 7.64,2.54; 5 10.18,0; 6 10.18,2.54; 7 12.72,0; 8 12.72,2.54
KK-156-3 = drill 1.7 pad 2.184 long: 1 -3.96,0; 2 0,0; 3 3.96,0
C0805 = smd 1.3 x 1.5: 1 -0.95,0; 2 0.95,0
C1206 = smd 1.6 x 1.8: 1 -1.4,0; 2 1.4,0
C0805K = smd 1.3 x 1.6: 1 -1,0; 2 1,0
LD09P24A4GV00LF = drill 0.9 pad 1.4 square: 1 0,0 | drill 0.9 pad 1.4: 2 2.74,0; 3 5.48,0; 4 8.22,0; 5 10.96,0; 6 1.37,-2.84; 7 4.11,-2.84; 8 6.85,-2.84; 9 9.59,-2.84 | drill 3.2 pad 4.8: MH1 -7.015,-1.42; MH2 17.975,-1.42
SMB = smd 2.4 x 2.4: A 2.2,0; C -2.2,0
DIOM7959X262N = smd 2.2 x 3.15: 1 -3.5,0; 2 3.5,0
KK-156-6 = drill 1.7 pad 2.184 long: 1 -9.9,0; 2 -5.94,0; 3 -1.98,0; 4 1.98,0; 5 5.94,0; 6 9.9,0
01530008 = drill 1.27 pad 2: 1 1.727,3.81; 2 -1.727,-3.81 | hole 3.785: 0,0
KK-156-2 = drill 1.7 pad 2.184 long: 1 -1.98,0; 2 1.98,0
3,2 = hole 3.2: 0,0
SO16 = smd 0.66 x 2.032: 1 -4.445,-3.073; 2 -3.175,-3.073; 3 -1.905,-3.073; 4 -0.635,-3.073; 5 0.635,-3.073; 6 1.905,-3.073; 7 3.175,-3.073; 8 4.445,-3.073; 9 4.445,3.073; 10 3.175,3.073; 11 1.905,3.073; 12 0.635,3.073; 13 -0.635,3.073; 14 -1.905,3.073; 15 -3.175,3.073; 16 -4.445,3.073
SO08 = smd 0.6 x 2.2: 1 -1.905,-2.6; 2 -0.635,-2.6; 3 0.635,-2.6; 4 1.905,-2.6; 5 1.905,2.6; 6 0.635,2.6; 7 -0.635,2.6; 8 -1.905,2.6
SO14 = smd 0.66 x 2.032: 1 -3.81,-3.073; 2 -2.54,-3.073; 3 -1.27,-3.073; 4 0,-3.073; 5 1.27,-3.073; 6 2.54,-3.073; 7 3.81,-3.073; 8 3.81,3.073; 9 2.54,3.073; 10 1.27,3.073; 11 0,3.073; 12 -1.27,3.073; 13 -2.54,3.073; 14 -3.81,3.073
SOIC8 = smd 0.6 x 2.2: 1 -1.905,-2.6; 2 -0.635,-2.6; 3 0.635,-2.6; 4 1.905,-2.6; 5 1.905,2.6; 6 0.635,2.6; 7 -0.635,2.6; 8 -1.905,2.6
T9AS1D1248T9A = drill 1.17 pad 1.755: 1 0,0; 2 -10.16,0 | drill 2.06 pad 3.09: 3 -13.97,12.7 | drill 2.19 pad 3.3: 4 3.81,15.24
T9AS1D12 = drill 2.19 pad 3.29: 1 -8.89,12.7; 2 8.89,15.24; 3 8.89,22.86 | drill 1.17 pad 1.77: 4 -5.08,0; 5 5.08,0
SML0805 = smd 1.2 x 1.2: A 1.05,0; C -1.05,0
SOIC08 = smd 0.66 x 2.032: 1 -1.905,-3.073; 2 -0.635,-3.073; 3 0.635,-3.073; 4 1.905,-3.073; 5 1.905,3.073; 6 0.635,3.073; 7 -0.635,3.073; 8 -1.905,3.073
SOT23 = smd 0.9 x 1.2: 1 -0.95,-1.2; 2 0.95,-1.2; 3 0,1.2
R1206 = smd 1.6 x 1.803: 1 -1.422,0; 2 1.422,0
R0805 = smd 1.3 x 1.5: 1 -0.95,0; 2 0.95,0
P1-17 = drill 1.702 pad 2.54 octagon: TP 0,0
TP11R = smd 1.1 x 1.1: TP 0,0

### Placement (x,y rotation side)
BMS_I/O  157.48,64.77 270 top
BMS_POWER/GND  140.97,58.42 90 top
C1  100.33,29.21 0 top
C2  100.33,26.67 0 top
C3  100.33,24.13 0 top
C4  48.26,22.86 90 top
C5  34.29,20.32 90 top
C6  105.41,87.63 270 top
C7  111.76,90.17 270 top
C8  92.96,90.55 270 top
C9  61.85,99.95 90 top
CAN1  143.51,24.13 90 top
CAN2  128.27,24.13 90 top
D1  100.33,69.85 180 top
D2  118.11,67.31 90 top
D3  57.15,13.97 90 top
D5  125.73,67.31 90 top
D7  33.02,73.66 0 top
D8  76.2,76.2 0 top
EMSDC  127,97.79 180 top
F1  127,82.55 180 top
F2  118.11,82.55 180 top
FAN  34.29,8.89 90 top
H1  6.35,97.79 90 top
H2  6.68,6.6 0 top
H3  160.48,99.28 0 top
H4  160.3,5.04 90 top
IC1  72.52,90.55 270 top
IC2  102.87,93.98 270 top
IC3  50.8,78.74 270 top
IC4  41.91,21.59 90 top
IC5  102.87,17.78 0 top
IC6  83.82,91.44 90 top
IC7  102.23,8.64 0 top
IC8  114.3,8.64 0 top
IC9  59.69,90.17 90 top
ISOMETER_I/O  129.54,5.08 0 top
K1  67.31,60.96 180 top
K2  102.87,59.69 180 top
K3  68.58,13.97 270 top
K4  35.56,59.69 180 top
LED1  96.52,74.93 0 top
LED2  54.61,25.15 270 top
LED3  30.48,22.86 270 top
LED4  49.53,91.44 90 top
LED5  52.07,91.44 90 top
LED6  46.99,91.44 90 top
LED7  35.56,78.74 180 top
LED8  76.2,81.28 180 top
MISC_I/O  7.62,43.18 90 top
OK2  39.37,90.17 270 top
POWER/GND  140.97,74.93 90 top
PRECHARGE/AIRS  153.67,91.44 141.3 top
Q1  40.64,78.74 180 top
Q2  82.55,83.82 180 top
Q3  83.82,100.33 0 top
Q4  40.64,73.66 90 top
R1  109.22,27.94 0 top
R2  60.96,96.52 0 top
R3  33.02,86.36 270 top
R4  109.22,30.48 0 top
R5  111.76,95.25 90 top
R6  52.07,96.52 270 top
R7  49.53,96.52 270 top
R8  45.72,96.52 270 top
R9  100.33,87.63 90 top
R10  93.98,95.25 0 top
R11  96.14,90.55 90 top
R12  40.64,83.82 0 top
R14  31.75,78.74 180 top
R15  69.85,81.28 180 top
R19  45.72,71.12 180 top
R20  101.6,74.93 180 top
R21  52.07,22.86 90 top
R22  30.48,17.78 90 top
R24  87.63,85.09 180 top
R25  78.74,99.06 270 top
THERAL_EX_I/O  22.86,95.25 226.4 top
TP1  44.45,86.36 0 top
TP2  60.96,73.66 0 top
TP3  52.07,100.33 0 top
TP4  91.44,81.28 0 top
TP5  72.39,100.33 0 top
TP6  60.96,81.28 0 top
TP7  49.53,86.36 0 top
TP8  26.67,87.63 0 top
TP9  26.67,86.36 0 top
TP10  35.56,96.52 0 top
TP11  55.63,100.33 0 top
TP12  67.31,100.33 0 top
TP14  85.09,72.39 0 top
TP16  58.93,100.33 0 top
TP17  87.63,81.28 0 top
TP21  35.56,81.28 0 top
TP23  92.71,69.85 0 top
TP24  34.29,25.4 0 top
WIFI_I/O  20.32,15.24 90 top

### Tracks (layer width: path | path; a pad name or v marks a point on that pad's centre or on a via)
+3V3  (via drill 0.35, 0.35 layers 1-15, 0.5 pad 0.8 layers 1-15)  (4 unrouted)
  Top 0.508: IC4.2 44.51,20.32 | 44.51,20.32 IC4.1 | 44.51,20.32 48.26,20.32 | 48.26,20.32 52.07,20.32 | R21.1 52.07,20.32 | C4.1 48.26,20.32 | IC2.4 102.23,92.08 102.87,92.71 102.87,95.25 103.5,95.89 IC2.8 107.95,95.89 | 107.95,95.89 111.44,95.89 R5.2 | 107.95,95.89 103.5,100.33 97.79,100.33 96.52,99.06 | 96.52,99.06 94.93,97.47 R10.2 | OK2.8 43.18,92.81 43.18,97.79 | 43.18,97.79 45.4,97.79 R8.1 R7.1 R6.1 | 43.18,97.79 v41.91,97.79 | 111.76,15.24 v111.76,16.51 | v53.34,20.32 52.07,20.32 | IC1.5 67.56,89.92 v67.31,90.17 | 96.52,99.06 v95.25,99.06
  Top 0.889: C1.1 96.52,29.21 96.52,26.67 | 96.52,26.67 96.52,24.13 | 96.52,24.13 96.52,21.59 | 96.52,21.59 96.52,11.43 | 96.52,11.43 98.15,11.43 IC7.14 | C2.1 96.52,26.67 | C3.1 96.52,24.13 | 96.52,11.43 96.52,5.08 | 111.76,13.97 119.38,13.97 120.65,12.7 120.65,3.81 119.38,2.54 99.06,2.54 96.52,5.08 | 111.76,13.97 110.49,12.7 IC8.14 | 111.76,13.97 111.76,15.24 | IC5.16 97.69,21.59 96.52,21.59 | 96.52,5.08 v93.98,5.08
  Route15 2.54: 76.2,12.7 68.58,20.32 v53.34,20.32
  pour Route15 (rank 2): 0,104.14 165.1,104.14 167.64,101.6 167.64,0 1.27,0 0,-1.27
+12V  (via drill 0.35, 0.35 layers 1-15, 0.5 pad 0.8 layers 1-15)  (6 unrouted)
  Top 0.889: K1.1 71.12,64.77 71.12,76.2 | 71.12,76.2 69.85,77.47 68.58,77.47 | 68.58,77.47 64.77,77.47 | R15.2 68.9,77.79 68.58,77.47 | D8.C 71.12,76.2 | K4.1 33.02,62.23 33.02,69.85 27.94,69.85 27.94,72.39 | 27.94,72.39 29.21,73.66 D7.C | 27.94,72.39 27.94,78.74 | R14.2 27.94,78.74 | K2.4 107.95,64.43 D1.C 105.41,69.85 105.41,74.93 | 105.41,74.93 v105.41,77.47 | R20.1 105.41,74.93 | R22.1 30.48,13.97 34.29,13.97 | 34.29,13.97 C5.1 | 34.29,13.97 39.37,13.97 | 39.37,13.97 39.37,19.62 IC4.8 | 39.37,13.97 44.45,8.89 50.8,8.89 | 50.8,8.89 57.15,8.89 | 57.15,8.89 63.5,8.89 | 63.5,8.89 K3.1 | D3.C 57.15,8.89 | 63.5,8.89 67.31,8.89 81.28,22.86 K3.3 | 50.8,8.89 49.53,10.16 v49.53,11.43 | D2.1 120.96,60.96 121.92,60.96 | 121.92,60.96 123.19,60.96 125.73,63.5 D5.1 | 27.94,78.74 v26.67,80.01 | 121.92,60.96 v121.92,59.69
  pour Route15: 59.69,5.08 38.1,5.08 2.54,40.64 2.54,54.61 15.24,67.31 15.24,76.2 22.86,83.82 52.07,83.82 58.42,77.47 59.69,77.47 64.77,82.55 81.28,82.55 86.36,77.47 101.6,77.47 104.14,80.01 111.76,80.01 119.38,72.39 127,72.39 135.89,63.5 144.78,63.5 144.78,33.02 148.59,29.21 148.59,6.35 146.05,3.81 125.73,3.81 121.92,7.62 121.92,21.59 80.01,21.59 78.74,20.32 74.93,20.32
AMS_LED-  (via drill 0.35)
  Top 0.508: Q1.3 39.37,76.27 v39.37,76.2 | MISC_I/O.5 10.14,55.88 v15.24,55.88
  Bottom 0.508: v39.37,76.2 19.05,55.88 v15.24,55.88
CAN1_H  (via drill 0.35 layers 1-2, 0.5 pad 0.8 layers 1-15)
  Top 0.508: BMS_I/O.1 157.5,59.67 158.75,58.42 158.75,49.53 144.78,35.56 144.78,30.88 CAN1.3 135.02,38.1 124.46,38.1 121.92,35.56 121.92,33.02 120.65,31.75 v115.57,31.75 | v17.78,46.99 25.4,39.37 25.4,34.29 27.94,31.75 v102.87,31.75
  Route2 0.508: MISC_I/O.4 6.37,49.53 15.24,49.53 v17.78,46.99
  Route15 0.508: v115.57,31.75 v102.87,31.75
CAN1_L  (via drill 0.35)
  Top 0.508: v105.41,33.02 v118.11,33.02
  Route2 0.508: v17.78,52.07 16.49,53.36 9.28,53.36 8.11,54.53 7.13,54.53 5.96,53.36 MISC_I/O.6
  Bottom 0.508: BMS_I/O.3 158.75,55.86 158.75,50.33 CAN1.5 143.51,35.56 140.97,38.1 125.73,38.1 120.65,33.02 v118.11,33.02 | v17.78,52.07 34.29,52.07 53.34,33.02 v105.41,33.02
CAN2_H  (via drill 0.35)
  Top 0.508: R4.1 R1.1 110.34,25.4 | CAN2.3 124.06,25.4 110.34,25.4 | 110.34,25.4 v109.22,25.4
  Bottom 0.508: v109.22,25.4 90.17,6.35 45.72,6.35 36.83,15.24 27.94,15.24 | 27.94,15.24 20.32,22.86 WIFI_I/O.3 | 27.94,15.24 19.05,15.24 10.16,24.13 10.16,53.36 MISC_I/O.7 7.62,77.74 17.17,87.29 17.44,87.29 17.78,87.63 17.78,89.53 THERAL_EX_I/O.3 | CAN2.3 130,27.88 130,27.78 131.11,26.67 134.62,26.67 139.7,21.59 152.4,21.59 161.29,30.48 161.29,53.32 BMS_I/O.6
CAN2_L  (via drill 0.35)
  Top 0.508: R1.2 R4.2 113.03,30.48 | CAN2.5 123.66,30.48 113.03,30.48 | 113.03,30.48 v113.03,29.21 | v7.62,25.4 16.14,25.4 17.3,24.25 19.15,24.25 WIFI_I/O.5
  Bottom 0.508: v113.03,29.21 110.49,26.67 107.95,26.67 90.17,8.89 90.17,7.62 45.38,7.62 37.1,15.9 29.84,15.9 WIFI_I/O.5 | v7.62,25.4 2.54,30.48 2.54,53.36 MISC_I/O.8 5.08,83.82 10.16,88.9 14.82,88.9 THERAL_EX_I/O.5 | CAN2.5 129.54,33.82 129.54,30.48 130.67,29.35 131.57,29.35 132.98,27.94 135.89,27.94 140.97,22.86 151.13,22.86 160.02,31.75 BMS_I/O.8
CHARGE_POWER  (via drill 0.35, 0.5 pad 0.8 layers 1-15)
  Top 0.889: F1.1 125.73,78.28 D5.2 138.12,58.42 BMS_POWER/GND.2 | v11.43,68.58 v12.7,69.85 20.55,62 v21.36,62
  Route15 0.889: F1.1 125.27,55.42 121.92,52.07 31.3,52.07 v21.36,62 | THERAL_EX_I/O.2 22.45,88.53 22.45,79.6 v12.7,69.85
  Bottom 0.889: WIFI_I/O.2 11.43,26.69 v11.43,68.58
CHARGE_SAFE  (via drill 0.35, 0.35 layers 1-15, 0.5 pad 0.8 layers 1-15)
  Top 0.508: TP3.TP 53.95,98.45 53.95,92.05 52.29,90.39 LED5.C 52.07,90.17 v53.34,88.9 IC9.12 | v113.03,71.12 v111.76,71.12
  Route15 0.508: v111.76,71.12 93.82,71.12 93.41,71.53 86.61,71.53 85.79,70.71 69.15,70.71 59.28,80.58 59.28,85.09 55.47,88.9 v53.34,88.9
  Bottom 0.508: BMS_I/O.2 153.65,66.04 135.89,66.04 130.81,71.12 v113.03,71.12
CHASSIS_GND
  Bottom 1.27: ISOMETER_I/O.3 137.16,5.06 137.16,2.54 21.59,2.54 8.89,15.24 8.89,47.01 MISC_I/O.1
DISCHARGE_ENABLE  (via drill 0.35)
  Top 0.508: LED4.C 52.29,87.63 | IC9.13 52.29,87.63 | IC1.9 73.3,83.82 | 60.96,83.82 73.3,83.82 | 60.96,83.82 52.07,83.82 | 52.07,83.82 49.53,83.82 | 49.53,83.82 44.45,83.82 | 44.45,83.82 43.18,82.55 | 43.18,82.55 41.59,80.96 Q1.1 | 44.45,83.82 R12.2 | IC3.6 IC3.5 43.18,77.47 43.18,82.55 | 49.53,83.82 TP7.TP | 52.29,87.63 52.07,87.41 52.07,83.82 | TP6.TP 60.96,83.82 | 73.3,83.82 v74.93,83.82
  Bottom 0.508: v74.93,83.82 84.68,74.07 85.79,74.07 87.47,72.39 130.81,72.39 135.89,67.31 158.75,67.31 163.83,62.23 163.83,58.42 162.54,57.13 BMS_I/O.4
FAN+
  Top 0.889: FAN.1 80.57,6.91 K3.4
FAN_ENABLE  (via drill 0.35)
  Top 0.508: BMS_I/O.5 149.86,46.99 v138.43,46.99
  Top 0.889: K3.2 60.96,24.13 57.15,20.32 57.15,17.78 D3.A
  Bottom 0.508: K3.2 104.14,24.13 127,46.99 v138.43,46.99
GND  (via drill 0.35 layers 1-2, 0.5 pad 0.8 layers 1-2)  (23 unrouted)
  Top 0.889: IC1.11 77.22,88.65 | 77.22,88.65 77.47,88.9 77.47,90.17 | 77.47,90.17 77.47,92.71 | 77.47,92.71 76.45,93.73 IC1.15 | IC1.14 77.22,92.46 77.47,92.71 | IC1.12 77.22,89.92 77.47,90.17 | IC4.7 IC4.6 IC4.3 44.88,22.6 45.86,22.6 47.07,23.81 C4.2 49.53,25.08 49.53,26.67 | C8.2 92.71,89.35 92.71,85.09 | 92.71,85.09 93.98,83.82 96.52,83.82 | 100.33,83.82 105.41,83.82 | 105.41,83.82 111.76,83.82 C7.2 | C6.2 105.41,83.82 | R9.1 100.33,83.82 | R11.1 96.14,85.09 | 96.14,85.09 96.14,84.71 | C1.2 102.87,29.21 102.87,26.67 | 102.87,26.67 102.87,24.13 | C2.2 102.87,26.67 | C3.2 102.87,24.13 | 102.87,24.13 107.95,24.13 109.22,22.86 109.22,15.24 | 109.22,15.24 108.69,14.71 IC5.8 | IC7.7 109.22,8.74 | 109.22,8.74 109.22,15.24 | 109.22,8.74 109.22,3.81 | 109.22,3.81 118.11,3.81 IC8.7 | C5.2 34.29,24.13 | 34.29,24.13 TP24.TP | R12.1 36.83,83.82 36.8,83.79 | 109.22,3.81 v107.95,3.81 | Q1.2 v38.73,80.9 38.61,80.9 | R19.1 v48.26,71.12 | 77.22,88.65 77.47,88.39 v77.47,87.63 | R25.1 76.52,100.01 v76.2,100.33 | 84.84,99.06 Q3.2 86.29,99.13 v86.36,99.06 | 42.44,88.16 OK2.5 40.64,86.46 v40.64,86.36 | LED3.C 30.7,24.13 34.29,24.13 | 49.53,26.67 54.14,26.67 LED2.C | 49.53,26.67 v48.26,26.67 | IC2.1 98.42,95.89 v97.79,96.52 | v63.5,101.09 61.99,101.09 C9.2 | Q2.2 80.4,83.82 v80.01,83.82 | R24.1 92.71,85.09 | 96.52,83.82 v97.79,83.82 100.33,83.82 | 96.14,85.09 96.52,84.71 96.52,83.82 | v36.93,82.86 36.93,83.79 36.8,83.79 | 36.8,83.79 34.64,83.79 R3.2 | Q4.2 42.16,74.93 v43.18,74.93
  pour Route2: 0,104.14 167.64,104.14 167.64,-1.27 0,-1.27
HIGHEST_TEMP
  Top 0.508: TP8.TP 19.77,87.63 THERAL_EX_I/O.4
IMD_COIL_OUT
  Top 0.508: Q2.3 82.55,81.28 | 82.55,81.28 82.55,76.2 | 82.55,76.2 82.55,72.39 | K1.2 77.47,72.39 82.55,72.39 | D8.A 82.55,76.2 | 82.55,81.28 LED8.C | TP14.TP 82.55,72.39
IMD_LED-  (via drill 0.35)
  Top 0.508: Q3.3 83.75,101.6 v82.55,101.6 | MISC_I/O.3 11.41,54.61 v15.24,54.61
  Bottom 0.508: v82.55,101.6 68.96,88.01 53.72,88.01 20.32,54.61 v15.24,54.61
LOWEST_TEMP
  Top 0.508: THERAL_EX_I/O.6 26.44,86.13 TP9.TP
N$1
  Top 0.508: IC9.10 58.42,91.44 58.42,94.93 R2.1 58.93,97.6 TP16.TP
N$2
  Bottom 0.889: F2.2 126.47,86.36 128.07,87.96 129.39,87.96 130.32,87.02 130.32,85.58 POWER/GND.2
N$3  (via drill 0.35)
  Top 2.54: v132.08,67.31 132.08,71.12 134.62,73.66 134.62,81.28 135.89,82.55 158.7,82.55 PRECHARGE/AIRS.1
  Bottom 2.54: K2.2 104.14,54.61 132.08,54.61 v132.08,67.31
N$4
  Bottom 0.889: F1.2 129.28,85.81 129.28,85.14 137.16,77.27 137.16,72.39 138.58,70.97 POWER/GND.1
N$5  (via drill 0.35)
  Top 0.508: OK2.6 44.45,89.53 | 44.45,89.53 46.13,89.53 LED6.C 48.26,89.12 v48.26,88.9 | IC1.4 67.69,91.19 v66.8,92.08 | 44.45,89.53 TP1.TP
  Bottom 0.508: v66.8,92.08 66.17,91.44 50.8,91.44 v48.26,88.9
N$6
  Top 0.508: IC9.11 54.61,90.17 54.61,92.71 | IC9.9 54.61,92.71 | 54.61,92.71 54.61,93.98 | 54.61,93.98 IC9.8 | 54.61,93.98 54.61,99.31 TP11.TP
N$7
  Top 0.508: R3.1 35.24,89.53 OK2.3
N$8
  Top 0.508: IC6.11 82.55,91.44 83.5,90.49 Q2.1 83.57,85.09 85.09,85.09 | 85.09,85.09 R24.2 | TP17.TP 85.09,83.82 85.09,85.09
N$9
  Top 0.508: IC1.2 70.87,93.73 73.66,96.52 | 73.66,96.52 74.93,97.79 76.2,97.79 | 76.2,97.79 78.74,95.25 78.74,90.17 | 78.74,90.17 IC6.12 | 78.74,90.17 78.74,88.9 IC6.13 | 76.2,97.79 78.42,97.79 R25.2 81.85,98.11 Q3.1 | 73.66,96.52 72.39,97.79 TP5.TP
N$10
  Top 0.508: C9.1 61.91,98.89 R2.2 62.7,97.31 64.77,95.25 | IC1.6 67.31,88.65 65.66,90.3 65.66,94.36 64.77,95.25 | 64.77,95.25 64.77,97.79 TP12.TP
N$11  (via drill 0.35)
  Top 2.54: K2.1 111.76,63.5 107.95,67.31 v107.95,74.93
  Route2 2.54: PRECHARGE/AIRS.5 152.4,98.52 152.4,99.06 149.94,101.52 124.46,101.52 121.06,98.12 EMSDC.5
  Bottom 2.54: v107.95,74.93 107.95,82.55 121.06,95.66 EMSDC.5
N$12  (via drill 0.35)
  Top 2.54: v148.59,50.8 148.59,62.23 165.33,78.97 165.33,87.63 162.79,90.17 160.75,90.17 PRECHARGE/AIRS.2
  Bottom 2.54: K2.3 113.03,36.83 127,50.8 v148.59,50.8
N$13  (via drill 0.35)
  Top 0.889: K4.3 53.34,43.18 85.09,43.18 88.9,46.99 88.9,73.66 93.98,78.74 110.49,78.74 v111.76,80.01
  Bottom 0.889: v111.76,80.01 111.76,83.72 122.02,93.98 134.62,93.98 137.16,96.52 137.16,97.79 EMSDC.1
N$14
  Top 0.508: K1.4 82.55,45.72 87.63,50.8 87.63,73.66 95.25,81.28 111.76,81.28 123.19,92.71 129.54,92.71 132.94,96.11 EMSDC.2
N$15
  Top 0.889: K4.2 44.45,59.69 39.37,64.77 39.37,71.12 | 39.37,71.12 39.37,73.59 Q4.3 | 39.37,71.12 36.83,73.66 | D7.A 36.83,73.66 | 36.83,73.66 36.83,78.52 LED7.C 36.61,80.23 TP21.TP
N$16
  Top 0.508: R19.2 43.43,71.12 Q4.1 42.79,73.66 49.53,73.66 | 49.53,73.66 50.8,74.93 50.8,78.21 50.27,78.74 IC3.4 | TP2.TP 49.53,73.66
N$17
  Top 0.508: IC2.6 IC2.7 111.44,94.61 R5.1
  Top 0.889: R5.1 C7.1
N$18
  Top 0.889: R14.1 LED7.A
N$19
  Route2 2.54: EMSDC.4 EMSDC.3
N$20
  Top 0.508: R15.1 LED8.A
N$21
  Top 0.889: K4.4 38.1,50.8 78.74,50.8 K1.3
N$22
  Top 0.889: R20.2 LED1.A
N$23
  Top 0.508: R21.2 52.36,24.1 LED2.A
N$24
  Top 0.508: LED3.A R22.2
N$25
  Top 0.508: R7.2 LED4.A
N$26
  Top 0.508: R6.2 LED5.A
N$27  (via drill 0.35)
  Top 0.508: LED6.A v45.72,93.76 R8.2
N$28
  Top 0.508: IC2.2 98.42,94.61 97.16,93.34 96.52,93.34 | 92.96,93.34 92.96,95.18 R10.1 | 96.52,93.34 92.96,93.34 | 92.96,93.34 C8.1 | 96.52,93.34 96.52,91.88 R11.2
N$32
  Top 0.508: IC2.5 105.47,88.64 C6.1
OK_HS  (via drill 0.35)
  Top 0.508: TP10.TP 34.29,96.52 34.29,90.81 OK2.2 33.66,90.81 v33.02,90.17 | v48.26,30.48 102.98,30.48 108.85,24.61 110,24.61 123.19,11.43 138.45,11.43 ISOMETER_I/O.8
  Bottom 0.508: v33.02,90.17 33.02,74.77 14.46,56.2 14.46,54.28 15.24,53.5 15.24,36.83 21.59,30.48 v48.26,30.48
PRECHARGE_SELECT  (via drill 0.35)
  Top 0.508: v133.35,48.26 129.54,48.26 125.73,44.45 109.22,44.45 97.79,55.88 K2.5
  Top 0.889: K2.5 90.17,67.31 90.17,69.85 TP23.TP 95.25,69.85 | 95.25,69.85 95.25,74.71 LED1.C | 95.25,69.85 D1.A
  Bottom 0.508: BMS_I/O.7 153.69,48.26 v133.35,48.26
READY_POWER  (via drill 0.35, 0.35 layers 1-15)
  Top 0.889: F2.1 118.11,77.01 D2.2 122.21,70.81 123.91,69.11 125.2,69.11 139.85,54.46 BMS_POWER/GND.1 | v12.7,29.21 v12.7,31.75
  Route2 0.889: F2.1 43.29,78.74 37.23,84.8 35.85,84.8 29.09,91.56 THERAL_EX_I/O.1
  Route15 0.889: WIFI_I/O.1 16.49,16.51 13.97,16.51 12.7,17.78 v12.7,29.21
  Bottom 0.889: v12.7,31.75 12.7,64.77 24.13,76.2 24.13,90.17 22.74,91.56 THERAL_EX_I/O.1
STARTUP_RESET  (via drill 0.35, 0.65)
  Top 0.508: IC1.3 70.1,92.46 71.12,91.44 71.12,87.63 70.87,87.38 IC1.7 67.06,87.38 v66.04,86.36 | IC2.3 98.42,93.34 97.79,92.71 97.79,90.17 99.38,88.58 | 99.38,88.58 R9.2 | 99.38,88.58 97.79,88.58 v97.79,87.63
  Top 0.889: TP4.TP v91.44,83.82
  Bottom 0.508: v97.79,87.63 95.25,85.09 | v66.04,86.36 67.31,85.09 91.44,85.09 v91.44,83.82
  Bottom 0.61: 95.25,85.09 91.44,85.09
VDD  (via drill 0.35 layers 1-15, 0.5 pad 0.8 layers 1-15)
  Top 0.508: v74.93,96.52 75.59,95.86 IC1.16 | v80.01,86.36 80.01,86.89 IC6.14 | IC3.14 v55.88,82.55 | v54.5,85.09 55.35,85.09 IC9.14
  Route15 0.508: 77.47,99.06 v74.93,96.52 73.66,97.79 58.42,97.79 50.8,90.17 50.8,89.83 50.69,89.73 50.69,89.01 54.56,85.14 v54.5,85.09 54.61,85.09 55.88,83.82 v55.88,82.55 | 90.17,99.06 93.98,95.25 93.98,90.17 90.17,86.36 v80.01,86.36
  Route15 0.889: 90.17,99.06 77.47,99.06
VSS  (via drill 0.35 layers 1-15, 0.5 pad 0.8 layers 1-15)
  Top 0.508: IC3.7 v45.72,74.93 | IC9.7 63.13,94.35 63.13,94.75 v63.37,95 | IC1.8 69.44,85.95 v68.58,85.09
  Top 0.61: IC6.7 v88.9,95.25
  Route15 0.508: v45.72,74.93 50.8,74.93 57.15,81.28 57.15,83.82 51.44,89.53 52.07,90.17 55.88,90.17 60.96,85.09 v68.58,85.09 | v88.9,95.25 88.9,93.98 77.47,93.98 v68.58,85.09 | v63.37,95 63.75,95 64.77,93.98 64.64,93.98 63.37,92.71 63.37,90.3 v68.58,85.09